# EAGLE design quadcopter (EAGLE 9.7.0)
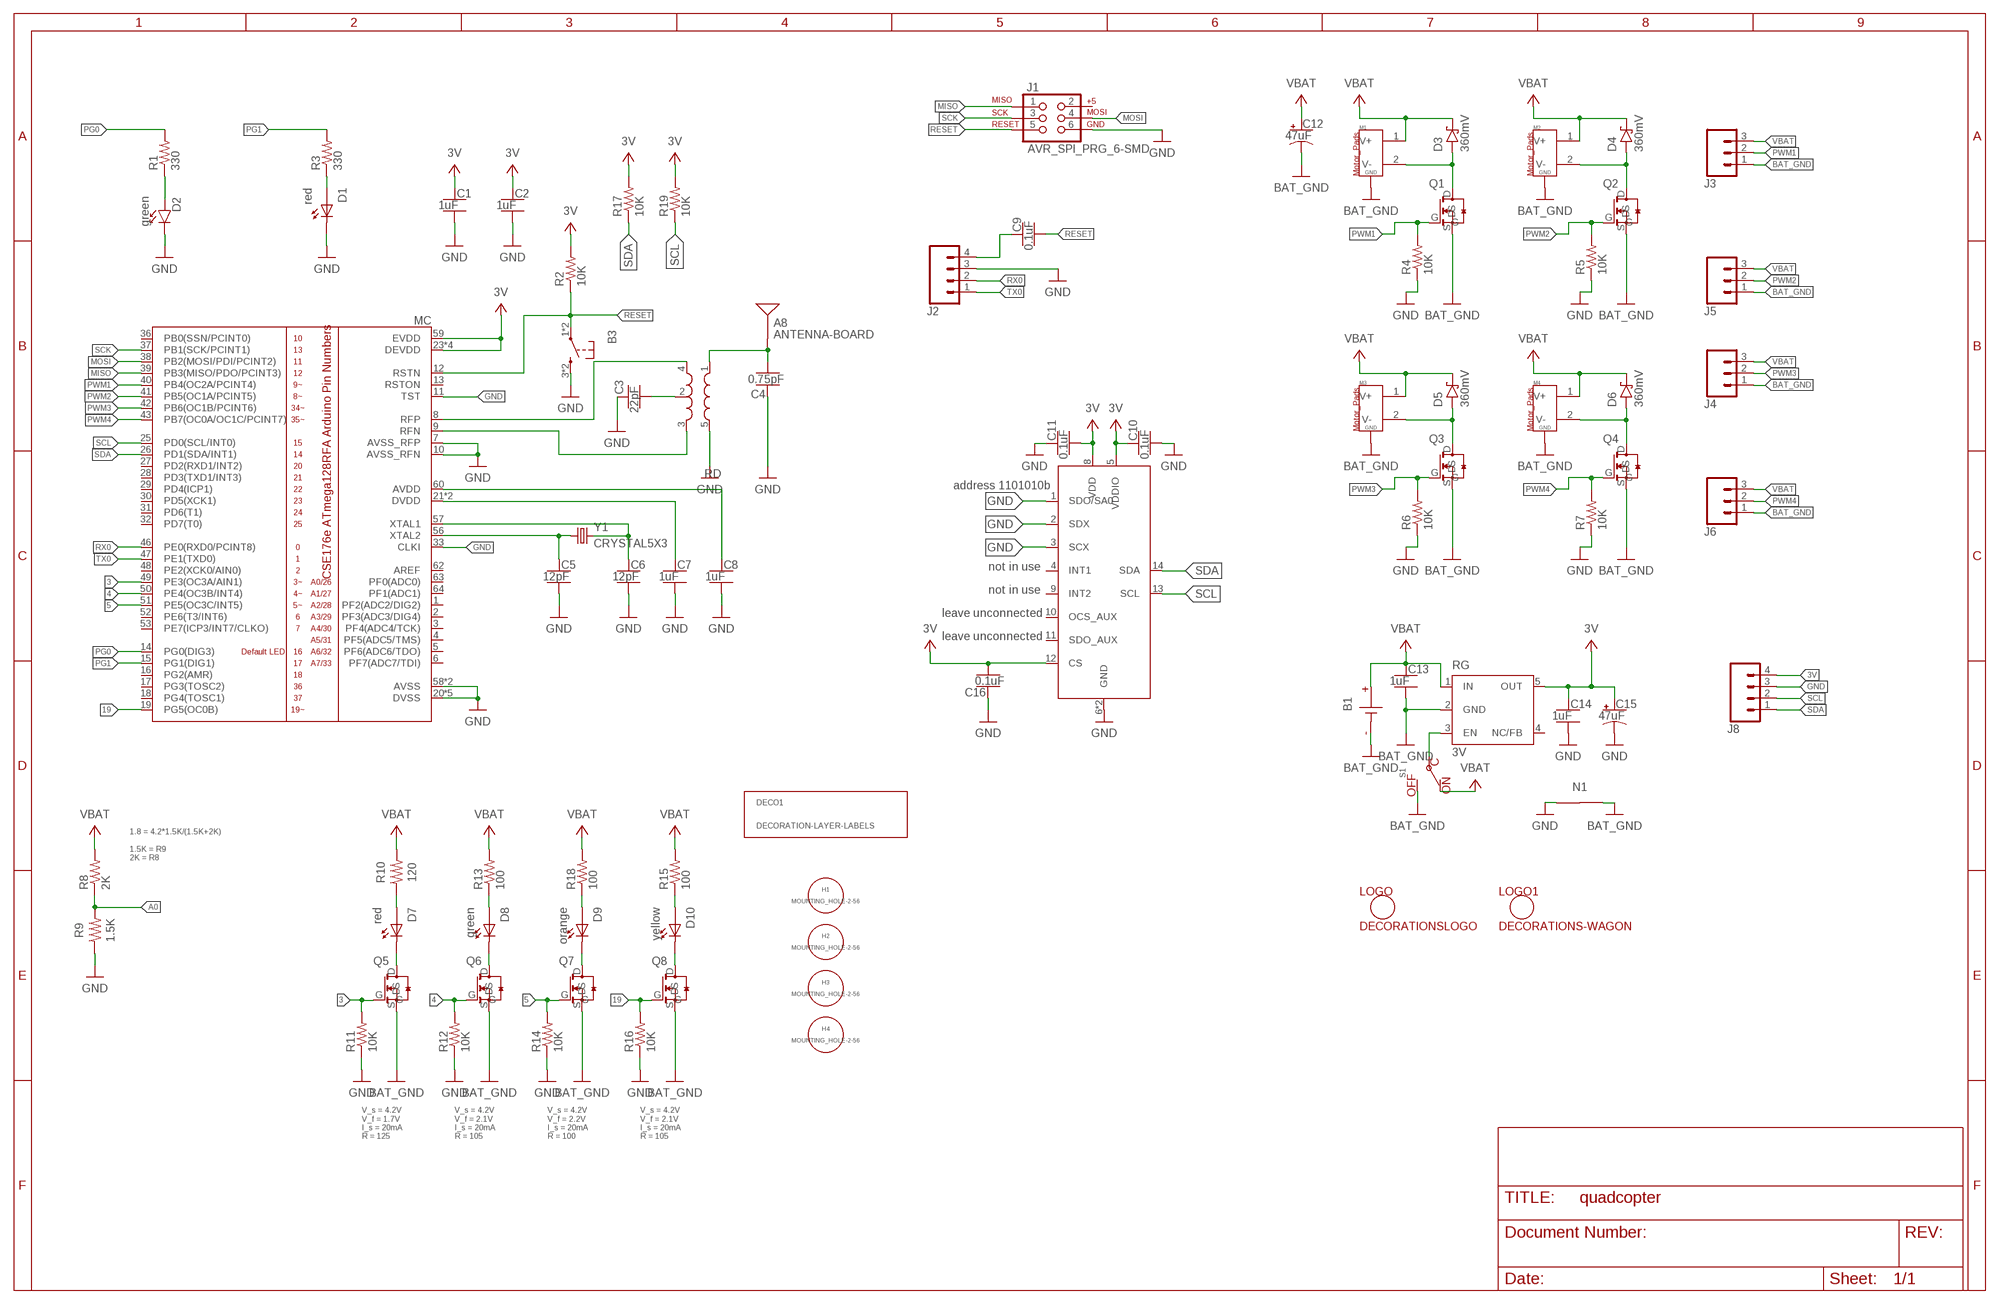
[diagram p0: schematic, sheet 1]
FRAME1 (FRAME_B_L): CREATOR: Unknown; DIST: Unknown; DISTPN: Unknown

## Parts
A8  ANTENNA-BOARD  [ANT_PCB_2.4GHZ_NRF8001_1.6MM_1OZ]
B1  BATTERY-SCREW-TERMINAL  [SCREW-TERMINAL-1X2-2.54MM]
B3  PUSHBUTTON_SMD-VERTICAL-1  [TE_FSM8JSMA_HS]
C1  1uF  CAPACITOR-NP_SMD-2012-0805_CERAMIC-1UF  [CAPC2012X140_HS]
C2  1uF  CAPACITOR-NP_SMD-2012-0805_CERAMIC-1UF  [CAPC2012X140_HS]
C3  22pF  CAPACITOR-NP_SMD-2012-0805_CERAMIC-22PF  [CAPC2012X140_HS]
C4  0.75pF  CAPACITOR-NP_SMD-2012-0805_CERAMIC-0.75PF  [CAPC2012X140_HS]
C5  12pF  CAPACITOR-NP_SMD-2012-0805_CERAMIC-12PF  [CAPC2012X140_HS]
C6  12pF  CAPACITOR-NP_SMD-2012-0805_CERAMIC-12PF  [CAPC2012X140_HS]
C7  1uF  CAPACITOR-NP_SMD-2012-0805_CERAMIC-1UF  [CAPC2012X140_HS]
C8  1uF  CAPACITOR-NP_SMD-2012-0805_CERAMIC-1UF  [CAPC2012X140_HS]
C9  0.1uF  CAPACITOR-NP_SMD-2012-0805_CERAMIC-0.1UF  [CAPC2012X140_HS]
C10  0.1uF  CAPACITOR-NP_SMD-2012-0805_CERAMIC-0.1UF  [CAPC2012X140_HS]
C11  0.1uF  CAPACITOR-NP_SMD-2012-0805_CERAMIC-0.1UF  [CAPC2012X140_HS]
C12  47uF  CAPACITOR-POL_47UF-SMD-1206-TAJA  [CAPMP3216X180]
C13  1uF  CAPACITOR-NP_SMD-2012-0805_CERAMIC-1UF  [CAPC2012X140_HS]
C14  1uF  CAPACITOR-NP_SMD-2012-0805_CERAMIC-1UF  [CAPC2012X140_HS]
C15  47uF  CAPACITOR-POL_47UF-SMD-1206-TAJA  [CAPMP3216X180]
C16  0.1uF  CAPACITOR-NP_SMD-2012-0805_CERAMIC-0.1UF  [CAPC2012X140_HS]
D1  red  LED-REDD-0805  [0805_LED]
D2  green  DIODE-LED_SMD-2012-0805-GREEN  [LEDSC125X200X120-2_HS]
D3  360mV  DIODE-SCHOTTKY_-SMD-SOD123  [SODFL3516X96]
D4  360mV  DIODE-SCHOTTKY_-SMD-SOD123  [SODFL3516X96]
D5  360mV  DIODE-SCHOTTKY_-SMD-SOD123  [SODFL3516X96]
D6  360mV  DIODE-SCHOTTKY_-SMD-SOD123  [SODFL3516X96]
D7  red  LED-RED-0805  [0805_LED]
D8  green  LED-GREEN-0805  [0805_LED]
D9  orange  LED-ORANGE-0805  [0805_LED]
D10  yellow  LED-YELLOW-0805  [0805_LED]
DECO1  DECORATION-LAYER-LABELS  [LAYER_LABELS]
H1  MOUNTING_HOLE-2-56  [2-56-MOUNTING-HOLE-NO-METAL]
H2  MOUNTING_HOLE-2-56  [2-56-MOUNTING-HOLE-NO-METAL]
H3  MOUNTING_HOLE-2-56  [2-56-MOUNTING-HOLE-NO-METAL]
H4  MOUNTING_HOLE-2-56  [2-56-MOUNTING-HOLE-NO-METAL]
IM  LSM_IMU-LGA-14L-6AXIS  [IMU_LSM6DS0X]
J1  AVR_SPI_PRG_6-SMD  [2X3-SMD]
J2  HEADER-4POS-0.1IN-FEMALE-SMD-BOTTOM-ENTRY  [HEADER-1X4-BOTTOM-ENTRY]
J3  HEADER-0.1IN-3POS  [HDRVR3W80P254_1X3_812X254X850B]
J4  HEADER-0.1IN-3POS  [HDRVR3W80P254_1X3_812X254X850B]
J5  HEADER-0.1IN-3POS  [HDRVR3W80P254_1X3_812X254X850B]
J6  HEADER-0.1IN-3POS  [HDRVR3W80P254_1X3_812X254X850B]
J8  HEADER-4POS-0.1IN-FEMALE  [HDRVR4W80P254_1X4_1066X254X850B]
LOGO  DECORATIONSLOGO  [LOGO]
LOGO1  DECORATIONS-WAGON  [WAGON]
M1  MOTOR_PADS_GND-MOLEX-SMD  [MOLEX-0532610271]
M2  MOTOR_PADS_GND-MOLEX-SMD  [MOLEX-0532610271]
M3  MOTOR_PADS_GND-MOLEX-SMD  [MOLEX-0532610271]
M4  MOTOR_PADS_GND-MOLEX-SMD  [MOLEX-0532610271]
MC  ATMEGA128RFA1  [QFN-64]
N1  NET_BRIDGE-NETTONET  [NET_BRIDGE]
Q1  MOSFET-SOT-23-NMOSFET  [SOT23-3-NMOSFET]
Q2  MOSFET-SOT-23-NMOSFET  [SOT23-3-NMOSFET]
Q3  MOSFET-SOT-23-NMOSFET  [SOT23-3-NMOSFET]
Q4  MOSFET-SOT-23-NMOSFET  [SOT23-3-NMOSFET]
Q5  MOSFET-SOT-23-NMOSFET  [SOT23-3-NMOSFET]
Q6  MOSFET-SOT-23-NMOSFET  [SOT23-3-NMOSFET]
Q7  MOSFET-SOT-23-NMOSFET  [SOT23-3-NMOSFET]
Q8  MOSFET-SOT-23-NMOSFET  [SOT23-3-NMOSFET]
R1  330  RESISTOR_SMD-2012-0805-330  [RESC2012X60_HS]
R2  10K  RESISTOR_SMD-2012-0805-10K  [RESC2012X60_HS]
R3  330  RESISTOR_SMD-2012-0805-330  [RESC2012X60_HS]
R4  10K  RESISTOR_SMD-2012-0805-10K  [RESC2012X60_HS]
R5  10K  RESISTOR_SMD-2012-0805-10K  [RESC2012X60_HS]
R6  10K  RESISTOR_SMD-2012-0805-10K  [RESC2012X60_HS]
R7  10K  RESISTOR_SMD-2012-0805-10K  [RESC2012X60_HS]
R8  2K  RESISTOR_SMD-2012-0805-2K  [RESC2012X60_HS]
R9  1.5K  RESISTOR-0805-1.5KOHM  [0805_RESISTOR]
R10  120  RESISTOR-0805-120OHM  [0805_RESISTOR]
R11  10K  RESISTOR_SMD-2012-0805-10K  [RESC2012X60_HS]
R12  10K  RESISTOR_SMD-2012-0805-10K  [RESC2012X60_HS]
R13  100  RESISTOR_SMD-2012-0805-100  [RESC2012X60_HS]
R14  10K  RESISTOR_SMD-2012-0805-10K  [RESC2012X60_HS]
R15  100  RESISTOR_SMD-2012-0805-100  [RESC2012X60_HS]
R16  10K  RESISTOR_SMD-2012-0805-10K  [RESC2012X60_HS]
R17  10K  RESISTOR_SMD-2012-0805-10K  [RESC2012X60_HS]
R18  100  RESISTOR_SMD-2012-0805-100  [RESC2012X60_HS]
R19  10K  RESISTOR_SMD-2012-0805-10K  [RESC2012X60_HS]
RD  BALUN0805  [BALUN]
RG  3V  TPS73633-DBVT3V  [SOT23-DBV]
S1  POWER-SWITCH-MFS201N-9-Z-SMD-EDGE  [JS102011SAQN]
Y1  CRYSTAL5X3  [CRYSTAL-SMD-5X3]

## Nets
3: MC.49(PE3(OC3A/AIN1)) Q5.G R11.2
3V [PWR]: C1.1 C2.1 C10.1 C11.2 C14.1 C15.1(+) C16.2 IM.5(VDDIO) IM.8(VDD) IM.12(CS) J8.4 MC.23(DEVDD) MC.34(DEVDD) MC.44(DEVDD) MC.54(DEVDD) MC.59(EVDD) R2.2 R17.2 R19.2 RG.5(OUT)
4: MC.50(PE4(OC3B/INT4)) Q6.G R12.2
5: MC.51(PE5(OC3C/INT5)) Q7.G R14.2
19: MC.19(PG5(OC0B)) Q8.G R16.2
A0: R8.1 R9.2
BAT_GND [HIGHCURRENT]: B1.1(N) C12.2(-) C13.2 J3.1 J4.1 J5.1 J6.1 M1.G1(GND) M1.G2(GND) M2.G1(GND) M2.G2(GND) M3.G1(GND) M3.G2(GND) M4.G1(GND) M4.G2(GND) N1.1 Q1.S Q2.S Q3.S Q4.S Q5.S Q6.S Q7.S Q8.S RG.2(GND) S1.A(OFF)
GND [PWR]: B3.3 B3.4 C1.2 C2.2 C3.1 C4.1 C5.2 C6.2 C7.2 C8.2 C10.2 C11.1 C14.2 C15.2(-) C16.1 D1.C D2.C IM.1(SDO/SA0) IM.2(SDX) IM.3(SCX) IM.6(GND) IM.7(GND) J1.6 J2.3 J8.3 MC.7(AVSS_RFP) MC.10(AVSS_RFN) MC.11(TST) MC.20(DVSS) MC.24(DVSS) MC.33(CLKI) MC.35(DVSS) MC.45(DVSS) MC.55(DVSS) MC.58(AVSS) MC.61(AVSS) N1.2 R4.1 R5.1 R6.1 R7.1 R9.1 R11.1 R12.1 R14.1 R16.1 RD.5(GND)
MISO: J1.1 MC.39(PB3(MISO/PDO/PCINT3))
MOSI: J1.4 MC.38(PB2(MOSI/PDI/PCINT2))
N$1: D1.A R3.1
N$2: C9.1 J2.4
N$3: C3.2 RD.2(GND)
N$4: MC.8(RFP) RD.4(OUT1)
N$5: MC.9(RFN) RD.3(OUT2)
N$6 [RFSIG]: A8.FEED(SIGNAL) C4.2 RD.1(IN)
N$7: C8.1 MC.60(AVDD)
N$8: C7.1 MC.21(DVDD) MC.22(DVDD)
N$9: C6.1 MC.57(XTAL1) Y1.3
N$10: C5.1 MC.56(XTAL2) Y1.1
N$11: D2.A R1.1
N$12 [HIGHCURRENT]: D3.2(A) M1.2(V-) Q1.D
N$13 [HIGHCURRENT]: D4.2(A) M2.2(V-) Q2.D
N$14 [HIGHCURRENT]: D5.2(A) M3.2(V-) Q3.D
N$15 [HIGHCURRENT]: D6.2(A) M4.2(V-) Q4.D
N$16: RG.3(EN) S1.C
N$19: D7.C Q5.D
N$20: D7.A R10.1
N$23: D8.C Q6.D
N$24: D8.A R13.1
N$27: D9.C Q7.D
N$28: D9.A R18.1
N$31: D10.C Q8.D
N$32: D10.A R15.1
PG0: MC.14(PG0(DIG3)) R1.2
PG1: MC.15(PG1(DIG1)) R3.2
PWM1: J3.2 MC.40(PB4(OC2A/PCINT4)) Q1.G R4.2
PWM2: J5.2 MC.41(PB5(OC1A/PCINT5)) Q2.G R5.2
PWM3: J4.2 MC.42(PB6(OC1B/PCINT6)) Q3.G R6.2
PWM4: J6.2 MC.43(PB7(OC0A/OC1C/PCINT7)) Q4.G R7.2
RESET: B3.1 B3.2 C9.2 J1.5 MC.12(RSTN) R2.1
RX0: J2.2 MC.46(PE0(RXD0/PCINT8))
SCK: J1.3 MC.37(PB1(SCK/PCINT1))
SCL: IM.13(SCL) J8.2 MC.25(PD0(SCL/INT0)) R19.1
SDA: IM.14(SDA) J8.1 MC.26(PD1(SDA/INT1)) R17.1
TX0: J2.1 MC.47(PE1(TXD0))
VBAT [HIGHCURRENT]: B1.2(P) C12.1(+) C13.1 D3.1(C) D4.1(C) D5.1(C) D6.1(C) J3.3 J4.3 J5.3 J6.3 M1.1(V+) M2.1(V+) M3.1(V+) M4.1(V+) R8.2 R10.2 R13.2 R15.2 R18.2 RG.1(IN) S1.B(ON)
Unconnected: IM.4(INT1) IM.9(INT2) IM.10(OCS_AUX) IM.11(SDO_AUX) J1.2 MC.1(PF2(ADC2/DIG2)) MC.2(PF3(ADC3/DIG4)) MC.3(PF4(ADC4/TCK)) MC.4(PF5(ADC5/TMS)) MC.5(PF6(ADC6/TDO)) MC.6(PF7(ADC7/TDI)) MC.13(RSTON) MC.16(PG2(AMR)) MC.17(PG3(TOSC2)) MC.18(PG4(TOSC1)) MC.27(PD2(RXD1/INT2)) MC.28(PD3(TXD1/INT3)) MC.29(PD4(ICP1)) MC.30(PD5(XCK1)) MC.31(PD6(T1)) MC.32(PD7(T0)) MC.36(PB0(SSN/PCINT0)) MC.48(PE2(XCK0/AIN0)) MC.52(PE6(T3/INT6)) MC.53(PE7(ICP3/INT7/CLKO)) MC.62(AREF) MC.63(PF0(ADC0)) MC.64(PF1(ADC1)) RG.4(NC/FB)

## Notes on the sheet
- address 1101010b
- not in use
- not in use
- leave unconnected
- leave unconnected
- 1.8 = 4.2*1.5K/(1.5K+2K)
  
  1.5K = R9
  2K = R8
- V_s = 4.2V
  V_f = 1.7V
  I_s = 20mA
  R = 125
- V_s = 4.2V
  V_f = 2.1V
  I_s = 20mA
  R = 105
- V_s = 4.2V
  V_f = 2.2V
  I_s = 20mA
  R = 100
- V_s = 4.2V
  V_f = 2.1V
  I_s = 20mA
  R = 105

## Library data of the parts
A8 = quadparts_prebuilt_2022:ANTENNA: Single endded antenna.; CREATOR: Swanson; DESC: trace antenna; DIST: NA; DISTPN: NA; MFR: NA; MOUNTING: NONE; MPN: NA; POPULATE: NO
B1 = quadparts_prebuilt_2022:BATTERY: Connections for a battery.; CREATOR: Swanson; DIST: DIGIKEY; DISTPN: ED10561-ND; MOUNTING: TH; PIN1: -; PIN2: +
B3 = quadparts_prebuilt_2022:PUSHBUTTON_: "Tactile" or "clicky" button.; CREATOR: Swanson; DIST: Digikey; DISTPN: 450-1129-ND; MFR: TE Connectivity Alcoswitch Switches; MOUNTING: SMD; MPN: FSM4JSMA; REVIEWER: Swanson
C1 C2 C7 C8 C13 C14 = quadparts_prebuilt_2022:CAPACITOR-NP_: Nonpolarized capacitor; CREATOR: Swanson; DIST: Digikey; DISTPN: 587-1281-1-ND; MFR: Taiyo Yuden; MOUNTING: SMD; MPN: TMK212B7105KG-T; REVIEWER: Swanson
C3 = quadparts_prebuilt_2022:CAPACITOR-NP_: Nonpolarized capacitor; CREATOR: Swanson; DESC: CAP CER 22PF 250V C0G/NP0 0805; DIST: Digikey; DISTPN: 490-5534-1-ND; MFR: Murata Electronics; MOUNTING: SMD; MPN: GRM21A5C2E220JW01D; PACKAGE: 0805; REVIEWER: Swanson
C4 = quadparts_prebuilt_2022:CAPACITOR-NP_: Nonpolarized capacitor; CREATOR: Swanson; DESC: CAP CER 0.75PF 100V C0G/NP0 0805; DIST: Digikey; DISTPN: 490-3585-1-ND; MFR: Murata Electronics; MOUNTING: SMD; MPN: GQM2195C2AR75CB01D; PACKAGE: 0805; REVIEWER: Swanson
C5 C6 = quadparts_prebuilt_2022:CAPACITOR-NP_: Nonpolarized capacitor; CREATOR: Swanson; DESC: CAP CER 12PF 250V C0G/NP0 0805; DIST: Digikey; DISTPN: 490-5531-1-ND; MFR: Murata Electronics; MOUNTING: SMD; MPN: GRM21A5C2E120JW01D; PACKAGE: 0805; REVIEWER: Swanson
C9-C11 C16 = quadparts_prebuilt_2022:CAPACITOR-NP_: Nonpolarized capacitor; CREATOR: Swanson; DESC: CAP CER 0.1UF 100V X7R 0805; DIST: Digikey; DISTPN: 445-1418-1-ND; MFR: TDK Corporation; MOUNTING: SMD; MPN: C2012X7R2A104K125AA; PACKAGE: 0805; REVIEWER: Swanson
C12 C15 = quadparts_prebuilt_2022:CAPACITOR-POL_: Polarized capacitor; CREATOR: Swanson; DESC: CAP TANT 47UF 10% 6.3V 1206; DIST: DIGIKEY; DISTPN: 478-11462-1-ND; MFR: AVX Corporation; MOUNTING: SMD; MPN: TAJA476K006SNJV; PACKAGE: 1206
D1 = custom_amish:LED; CREATOR: B HO; DIST: Digikey; DISTPN: 160-1178-1-ND
D2 = quadparts_prebuilt_2022:DIODE-LED_: Light emitting diode; CREATOR: Swanson; DIST: Digikey; DISTPN: 160-1179-1-ND; MFR: Lite-On Inc; MOUNTING: SMD; MPN: LTST-C170GKT; REVIEWER: Swanson
D3-D6 = quadparts_prebuilt_2022:DIODE-SCHOTTKY_: Schottky diode; CREATOR: Swanson; DESC: DIODE SCHOTTKY 30V 1.5A SFLAT; DIST: Digikey; DISTPN: CRS08QMCT-ND; MFR: Toshiba Semiconductor and Storage; MOUNTING: SMD; MPN: CRS08(TE85L,Q,M); REVIEWER: Swanson
D7 = LED:LED; CREATOR: B HO; DIST: Digikey; DISTPN: 350-2889-ND
D8 = LED:LED; CREATOR: B HO; DIST: Digikey; DISTPN: 350-2892-ND
D9 = LED:LED; CREATOR: B HO; DIST: Digikey; DISTPN: 350-3831-ND
D10 = LED:LED; CREATOR: B HO; DIST: Digikey; DISTPN: 350-2953-1-ND
DECO1 = quadparts_prebuilt_2022:DECORATION
H1-H4 = quadparts_prebuilt_2022:MOUNTING_HOLE
IM = custom_amish:LSM_IMU; CREATOR: B HO; DIST: Digikey; DISTPN: 497-18367-1-ND
J1 = quadparts_prebuilt_2022:AVR_SPI_PRG_6: AVR ISP 6 Pin This is the in-system programming (ISP) connector for Atmel Microcontrollers programming.; CREATOR: Swanson; DESC: CONN HEADER SMD 6POS 2.54MM; DIST: Digikey; DISTPN: 609-3487-2-ND; MFR: Amphenol ICC (FCI); MOUNTING: SMD; MPN: 95278-101A06LF
J2 = quadparts_prebuilt_2022:HEADER-4POS; CREATOR: Swanson; DESC: CONN RCPT 4POS 0.1 GOLD SMD; DIST: DIGIKEY; DISTPN: A121787CT-ND; MFR: TE Connectivity AMP Connectors; MOUNTING: SMD; MPN: 1241152-4
J3-J6 = quadparts_prebuilt_2022:HEADER-0.1IN-3POS; CREATOR: Swanson; DIST: Digikey; DISTPN: S7001-ND
J8 = quadparts_prebuilt_2022:HEADER-4POS; CREATOR: Swanson; DIST: Digikey; DISTPN: S7002-ND
LOGO = custom_amish:DECORATIONS; CREATOR: B HO; DIST: N/A; DISTPN: N/A
LOGO1 = custom_amish:DECORATIONS
M1-M4 = quadparts_prebuilt_2022:MOTOR_PADS_GND: Connections a brushed motor.; CREATOR: Swanson; DESC: CONN HEADER SMD R/A 2POS 1.25MM; DIST: DIGIKEY; DISTPN: WM7620CT-ND; MFR: Molex; MOUNTING: SMD; MPN: 532610271
MC = quadparts_prebuilt_2022:ATMEGA128RFA1: ATmega128RFA1 8-bit AVR Microcontroller with Low Power 2.4GHz Transceiver for ZigBee and IEEE 802.15.4; CREATOR: Swanson; DATASHEET: http://www.atmel.com/Images/Atmel-8266-MCU_Wireless-ATmega128RFA1_Datasheet.pdf; DESC: IC RF TXRX+MCU 802.15.4 64VFQFN; DIST: Digikey; DISTPN: ATMEGA128RFA1-ZU-ND; MFR: Microchip Technology; MOUNTING: SMD; MPN: ATMEGA128RFA1-ZU; PACKAGE: QFN; PRICE: 10.21; REVIEWER: Swanson
N1 = custom_amish:NET_BRIDGE; CREATOR: J SOONG; DIST: N/A; DISTPN: N/A
Q1-Q8 = custom_amish:MOSFET; CREATOR: B HO; DIST: Digikey; DISTPN: SI2302CDS-T1-E3CT-ND
R1 R3 = quadparts_prebuilt_2022:RESISTOR_: Resistor; CREATOR: Swanson; DIST: Digikey; DISTPN: 311-330ARCT-ND; MFR: Yageo; MOUNTING: SMD; MPN: RC0805JR-07330RL; REVIEWER: Swanson
R2 R4-R7 R11 R12 R14 R16 R17 R19 = quadparts_prebuilt_2022:RESISTOR_: Resistor; CREATOR: Swanson; DESC: RES SMD 10K OHM 5% 1/8W 0805; DIST: Digikey; DISTPN: 311-10KARCT-ND; MFR: Yageo; MOUNTING: SMD; MPN: RC0805JR-0710KL; PACKAGE: 0805; REVIEWER: Swanson
R8 = quadparts_prebuilt_2022:RESISTOR_: Resistor; CREATOR: Swanson; DESC: RES SMD 2K OHM 1% 1/8W 0805; DIST: DIGIKEY; DISTPN: YAG3718CT-ND; MFR: YAGEO; MOUNTING: SMD; MPN: AC0805FR-072KL; PACKAGE: 0805
R9 = custom_amish:RESISTOR; CREATOR: B HO; DIST: Digikey; DISTPN: 311-1.5KARCT-ND
R10 = custom_amish:RESISTOR; CREATOR: B HO; DIST: Digikey; DISTPN: 311-120ARCT-ND
R13 R15 R18 = quadparts_prebuilt_2022:RESISTOR_: Resistor; CREATOR: Swanson; DIST: Digikey; DISTPN: 311-100ARCT-ND; MFR: Yageo; MOUNTING: SMD; MPN: RC0805JR-07100RL; REVIEWER: Swanson
RD = quadparts_prebuilt_2022:BALUN: A balun to convert differential radio-frequency outputs from the microcontroller into a single-ended driver for the antenna.; CREATOR: Swanson; DATASHEET: http://katalog.we-online.de/pbs/datasheet/748421245.pdf; DESC: BALUN 2.4GHZ-2.5GHZ 50/100 0805; DIST: Digikey; DISTPN: 732-2230-1-ND; MFR: Wurth Electronics Inc.; MOUNTING: SMD; MPN: 748421245; PACKAGE: 0805; PRICE: 2.63; REVIEWER: Swanson
RG = quadparts_prebuilt_2022:TPS73633-DBVT: LP3985-series voltage regulators.; CREATOR: Swanson; DATASHEET: http://www.ti.com/lit/ds/symlink/lp3985.pdf; DIST: Digikey; DISTPN: LP3985IM5X-3.0/NOPBCT-ND; MFR: Texas Instruments; MOUNTING: SMD; MPN: LP3985IM5X-3.0/NOPB; PRICE: 0.59; REVIEWER: Swanson
S1 = quadparts_prebuilt_2022:POWER-SWITCH-MFS201N-9-Z; CREATOR: Swanson; DESC: SWITCH SLIDE SPDT 300MA 6V; DIST: DIGIKEY; DISTPN: 401-1999-1-ND; MFR: C&K; MOUNTING: SMD; MPN: JS102011SAQN
Y1 = quadparts_prebuilt_2022:CRYSTAL: Crystals to provide clock references for microcontrollers, etc.; CREATOR: Swanson; DATASHEET: http://www.abracon.com/Resonators/abm3b.pdf; DESC: CRYSTAL 16.0000MHZ 18PF SMD; DIST: Digikey; DISTPN: 535-9122-1-ND; MFR: Abracon LLC; MOUNTING: SMD; MPN: ABM3B-16.000MHZ-B2-T; PRICE: 0.68; PROD_ID: XTAL-08218; REVIEWER: Swanson

## Net classes
0 DEFAULT: width 0.127 mm
1 PWR: width 0.254 mm
2 HIGHCURRENT: width 0.762 mm, drill 0.61 mm
3 RFSIG: width 1.27 mm

## Board
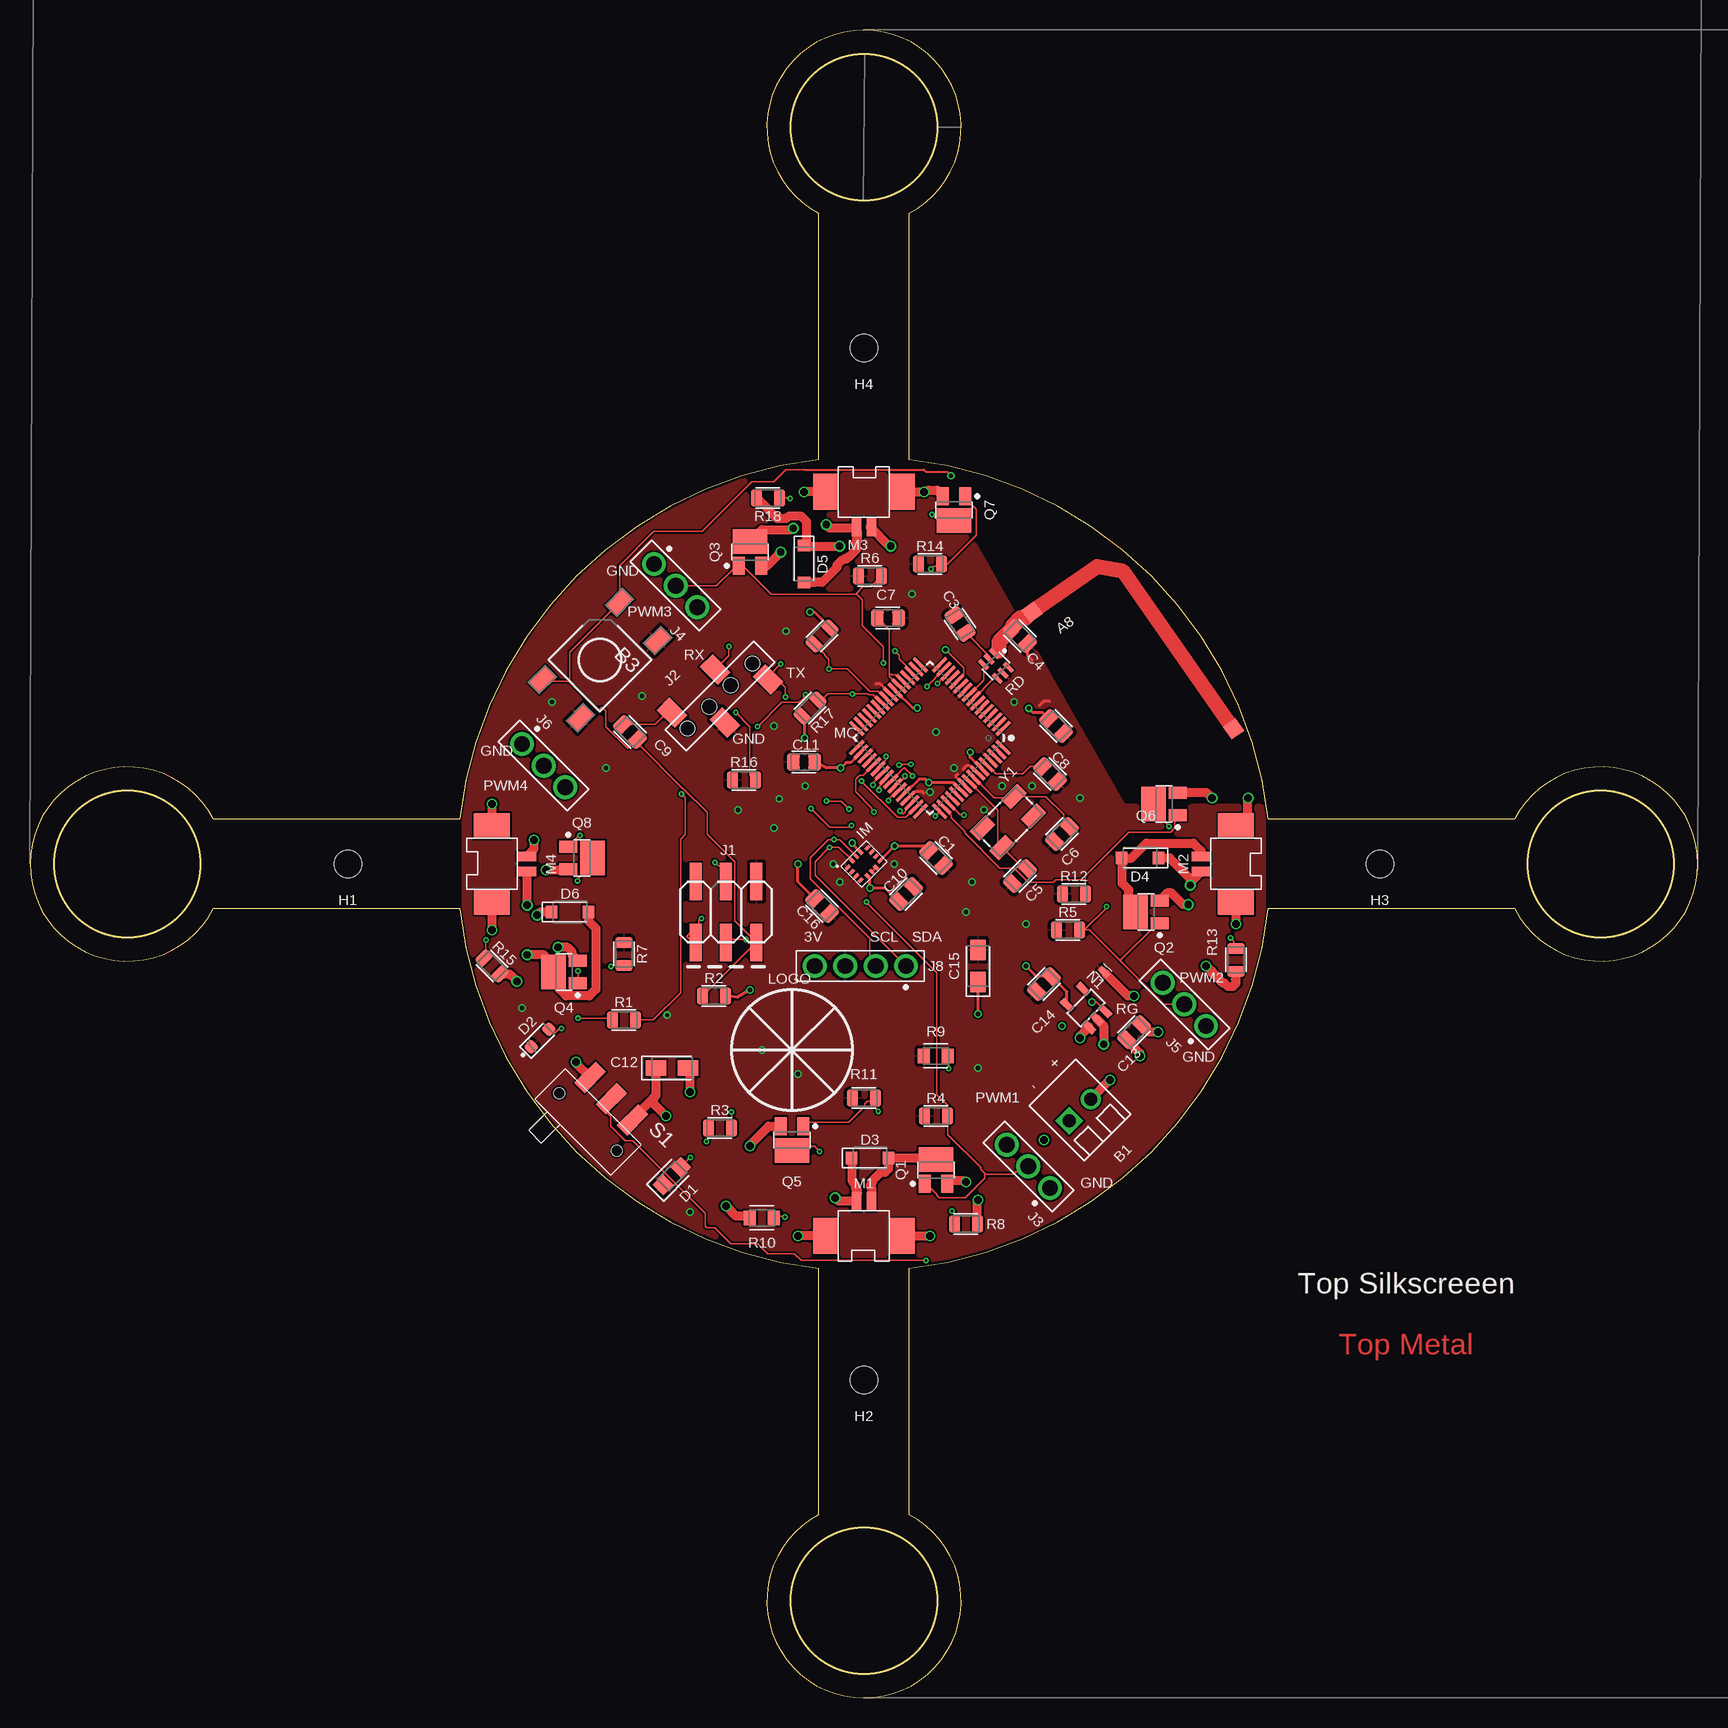
[diagram p1: board, top side]
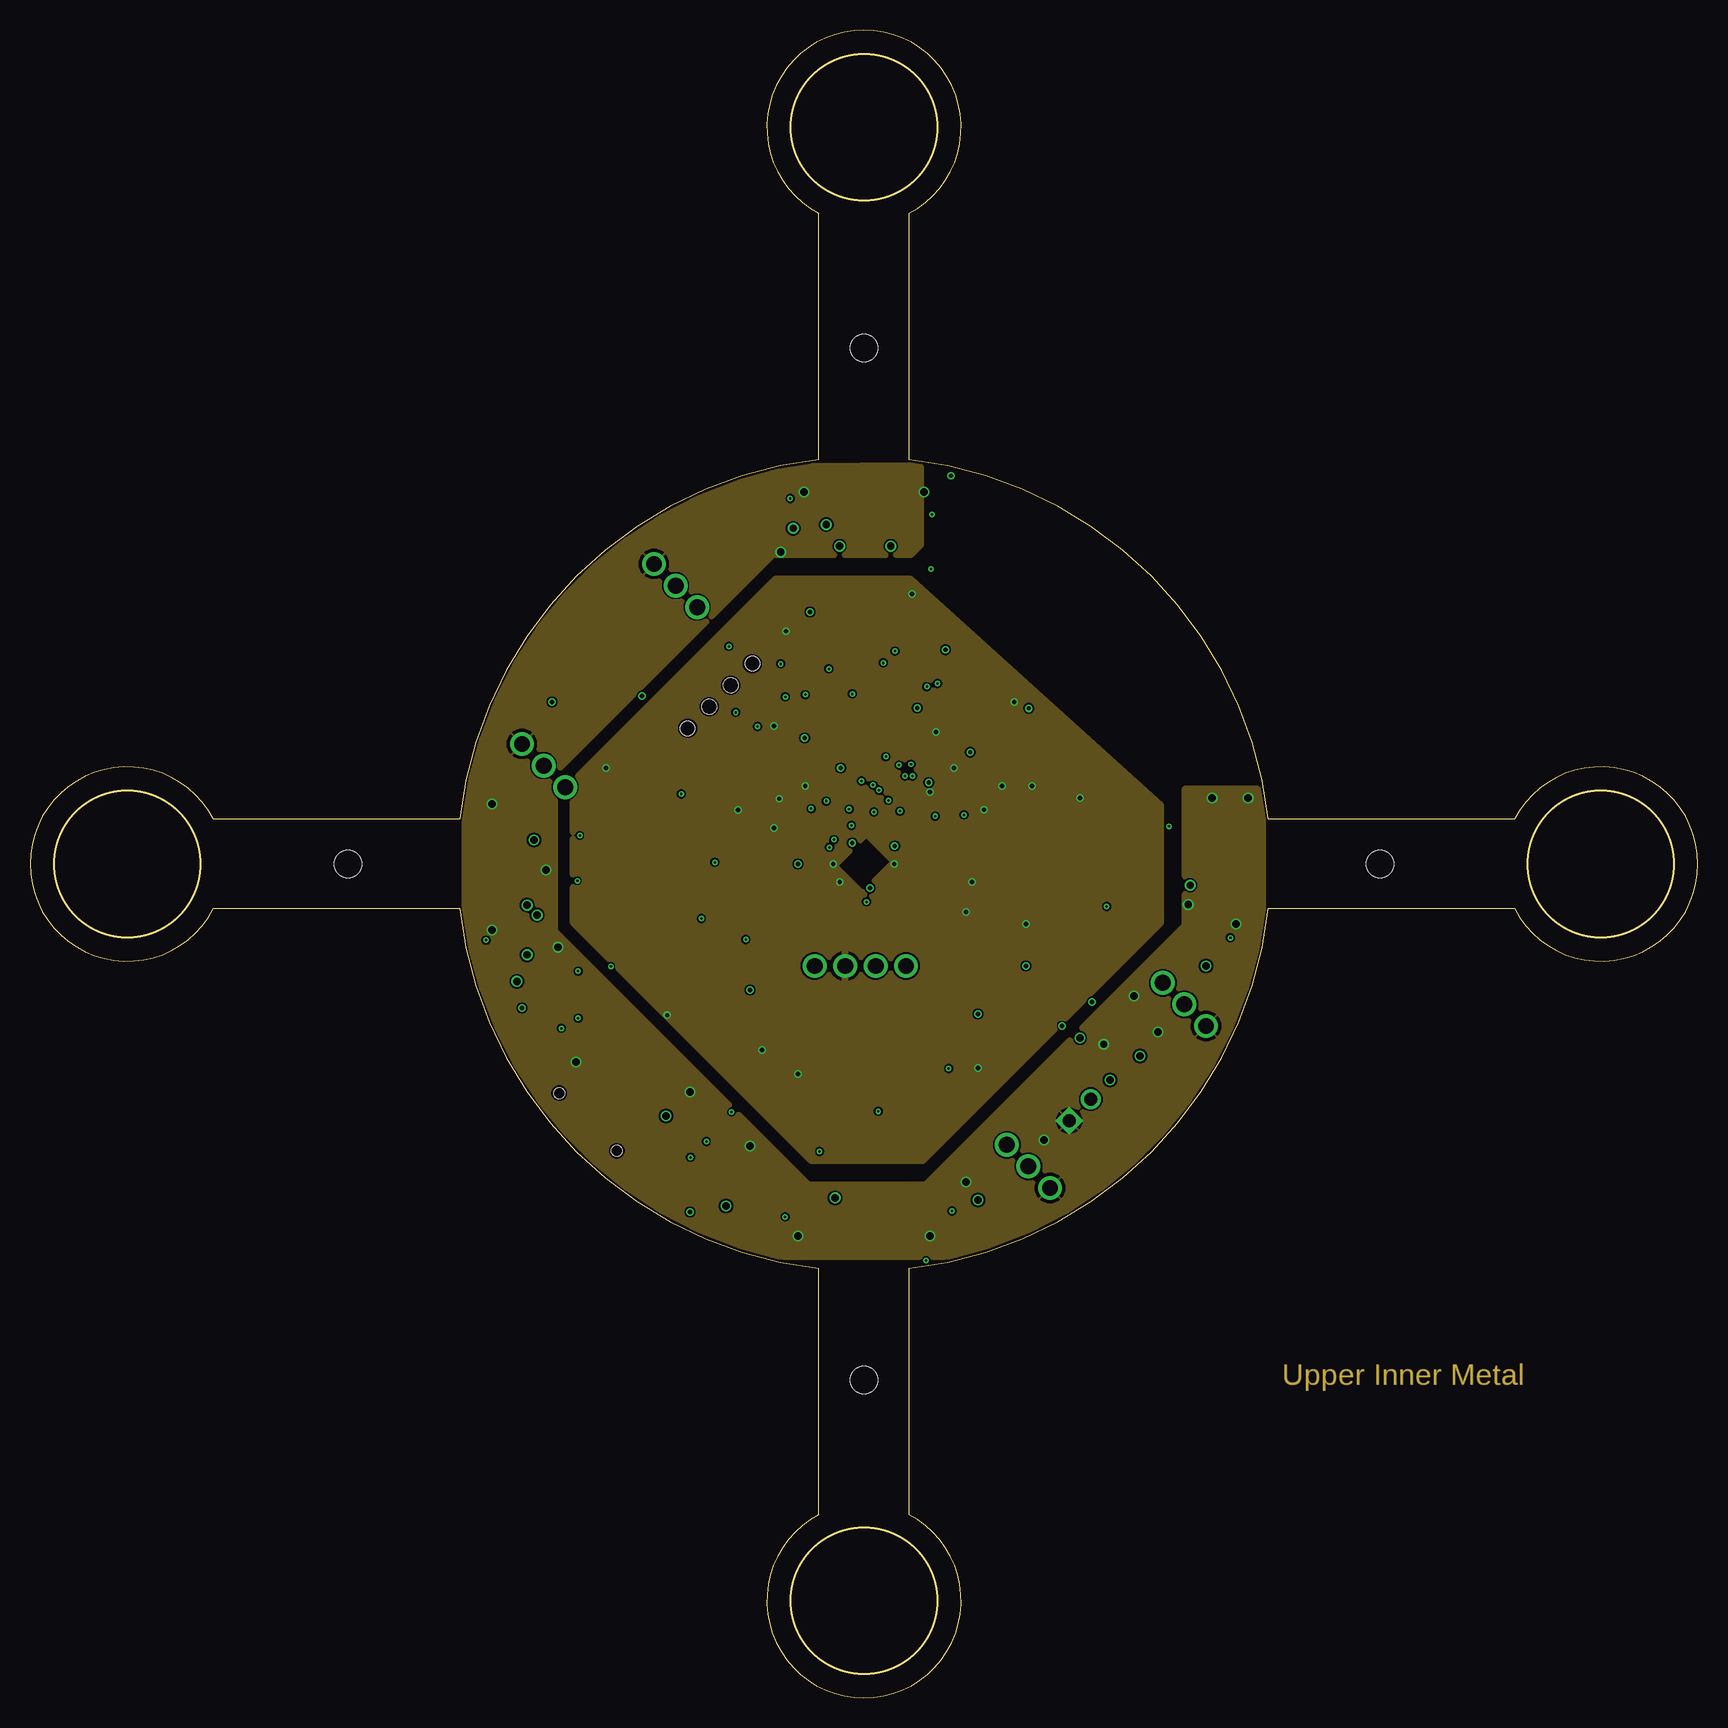
[diagram p2: board, inner layer Route2]
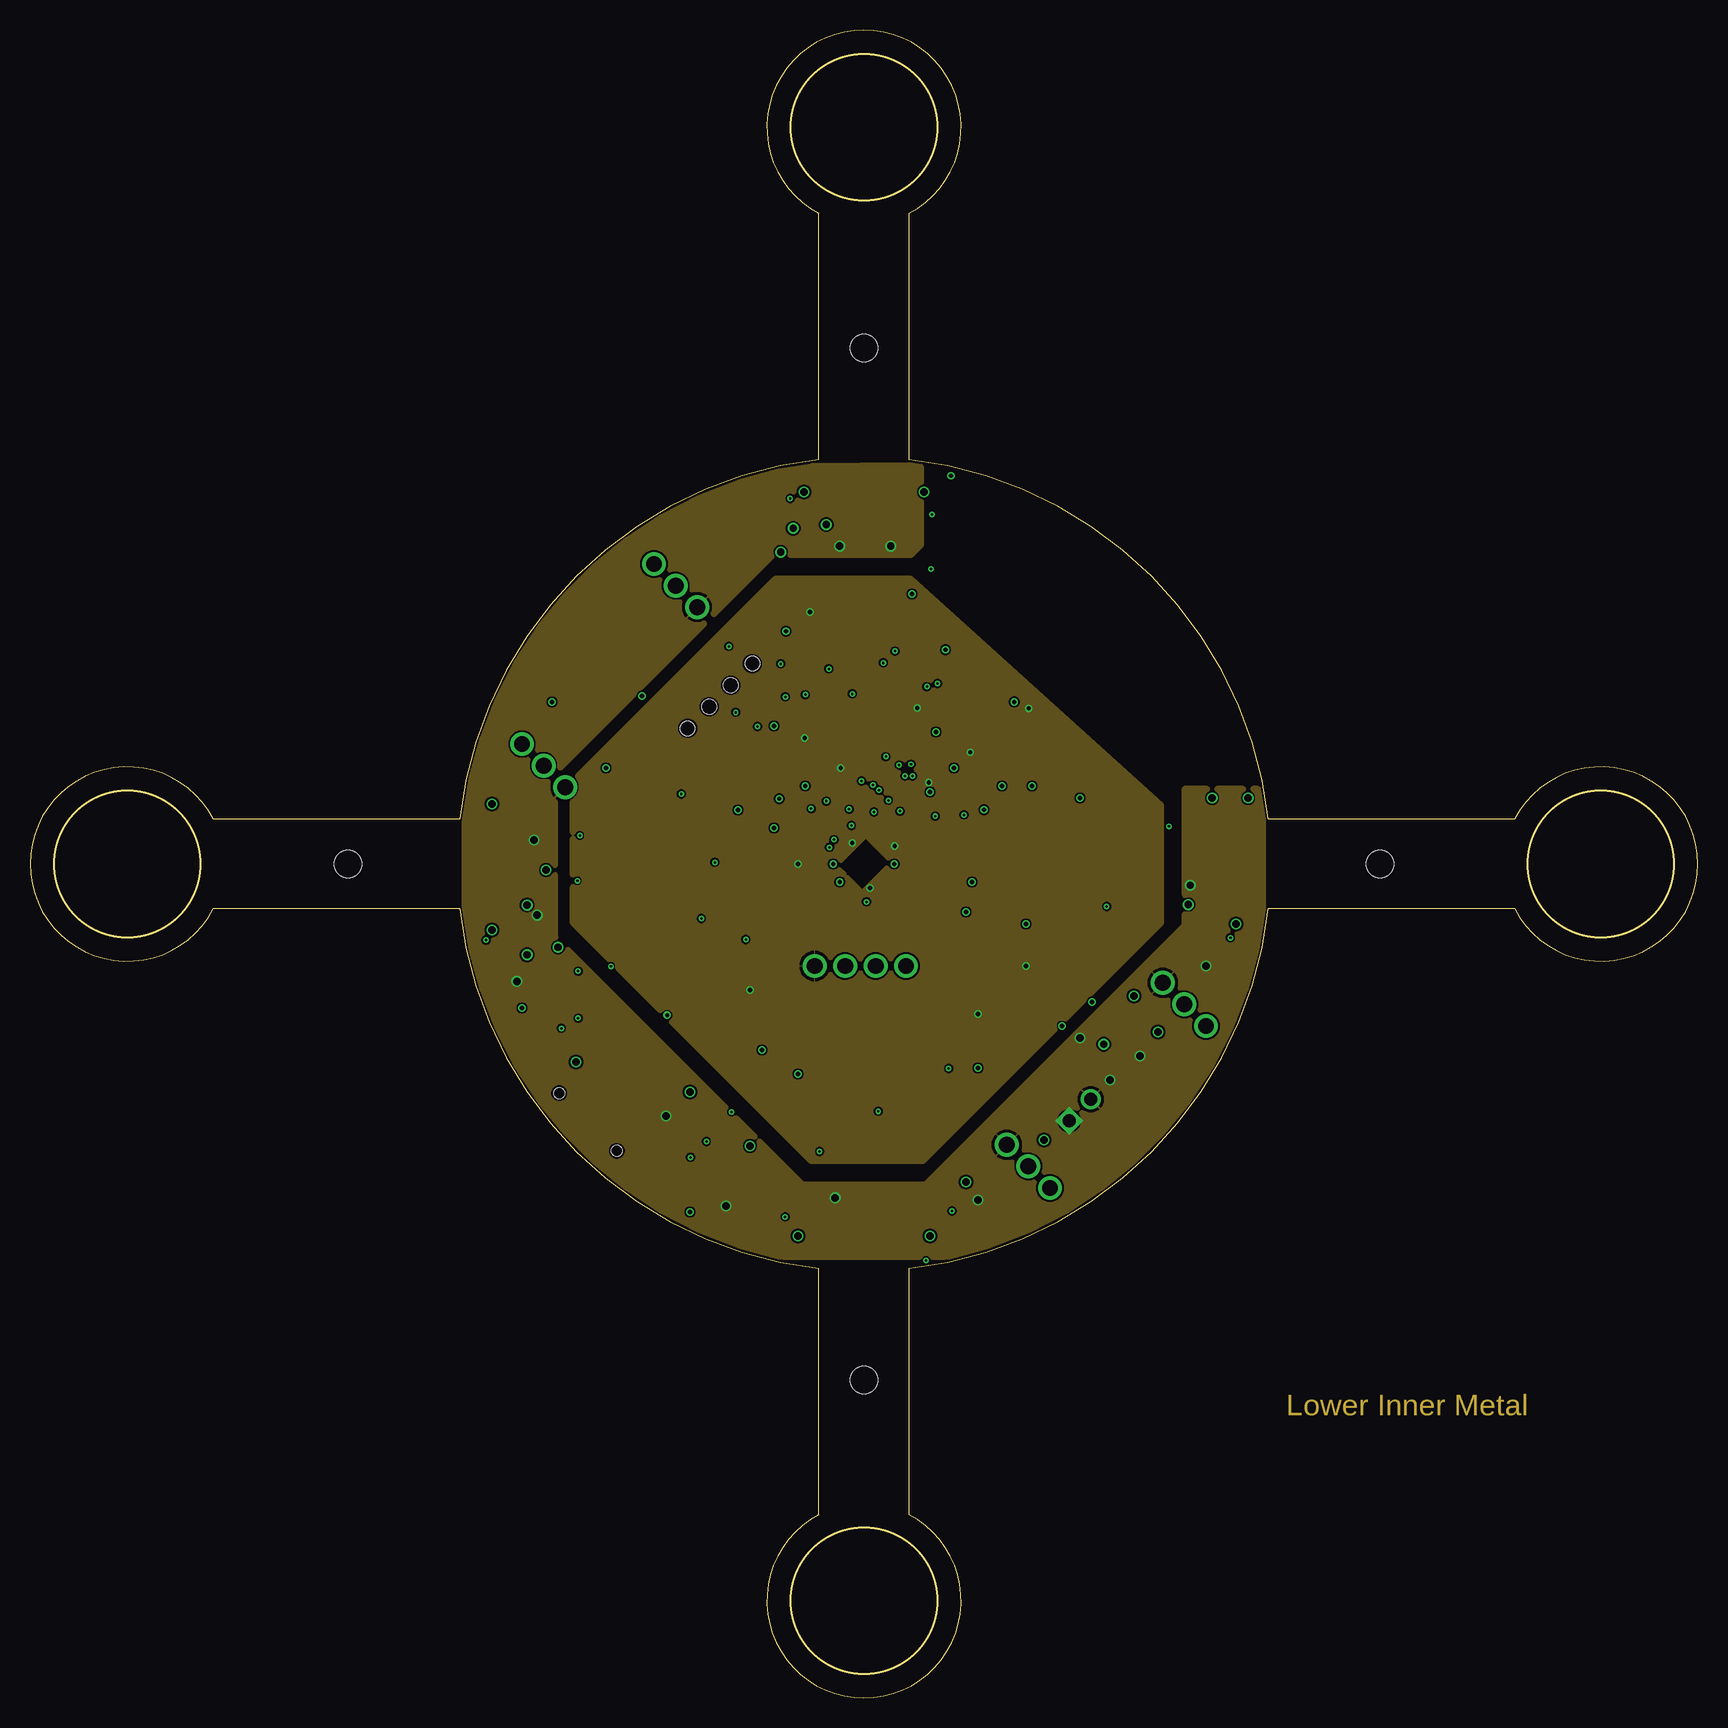
[diagram p3: board, inner layer Route15]
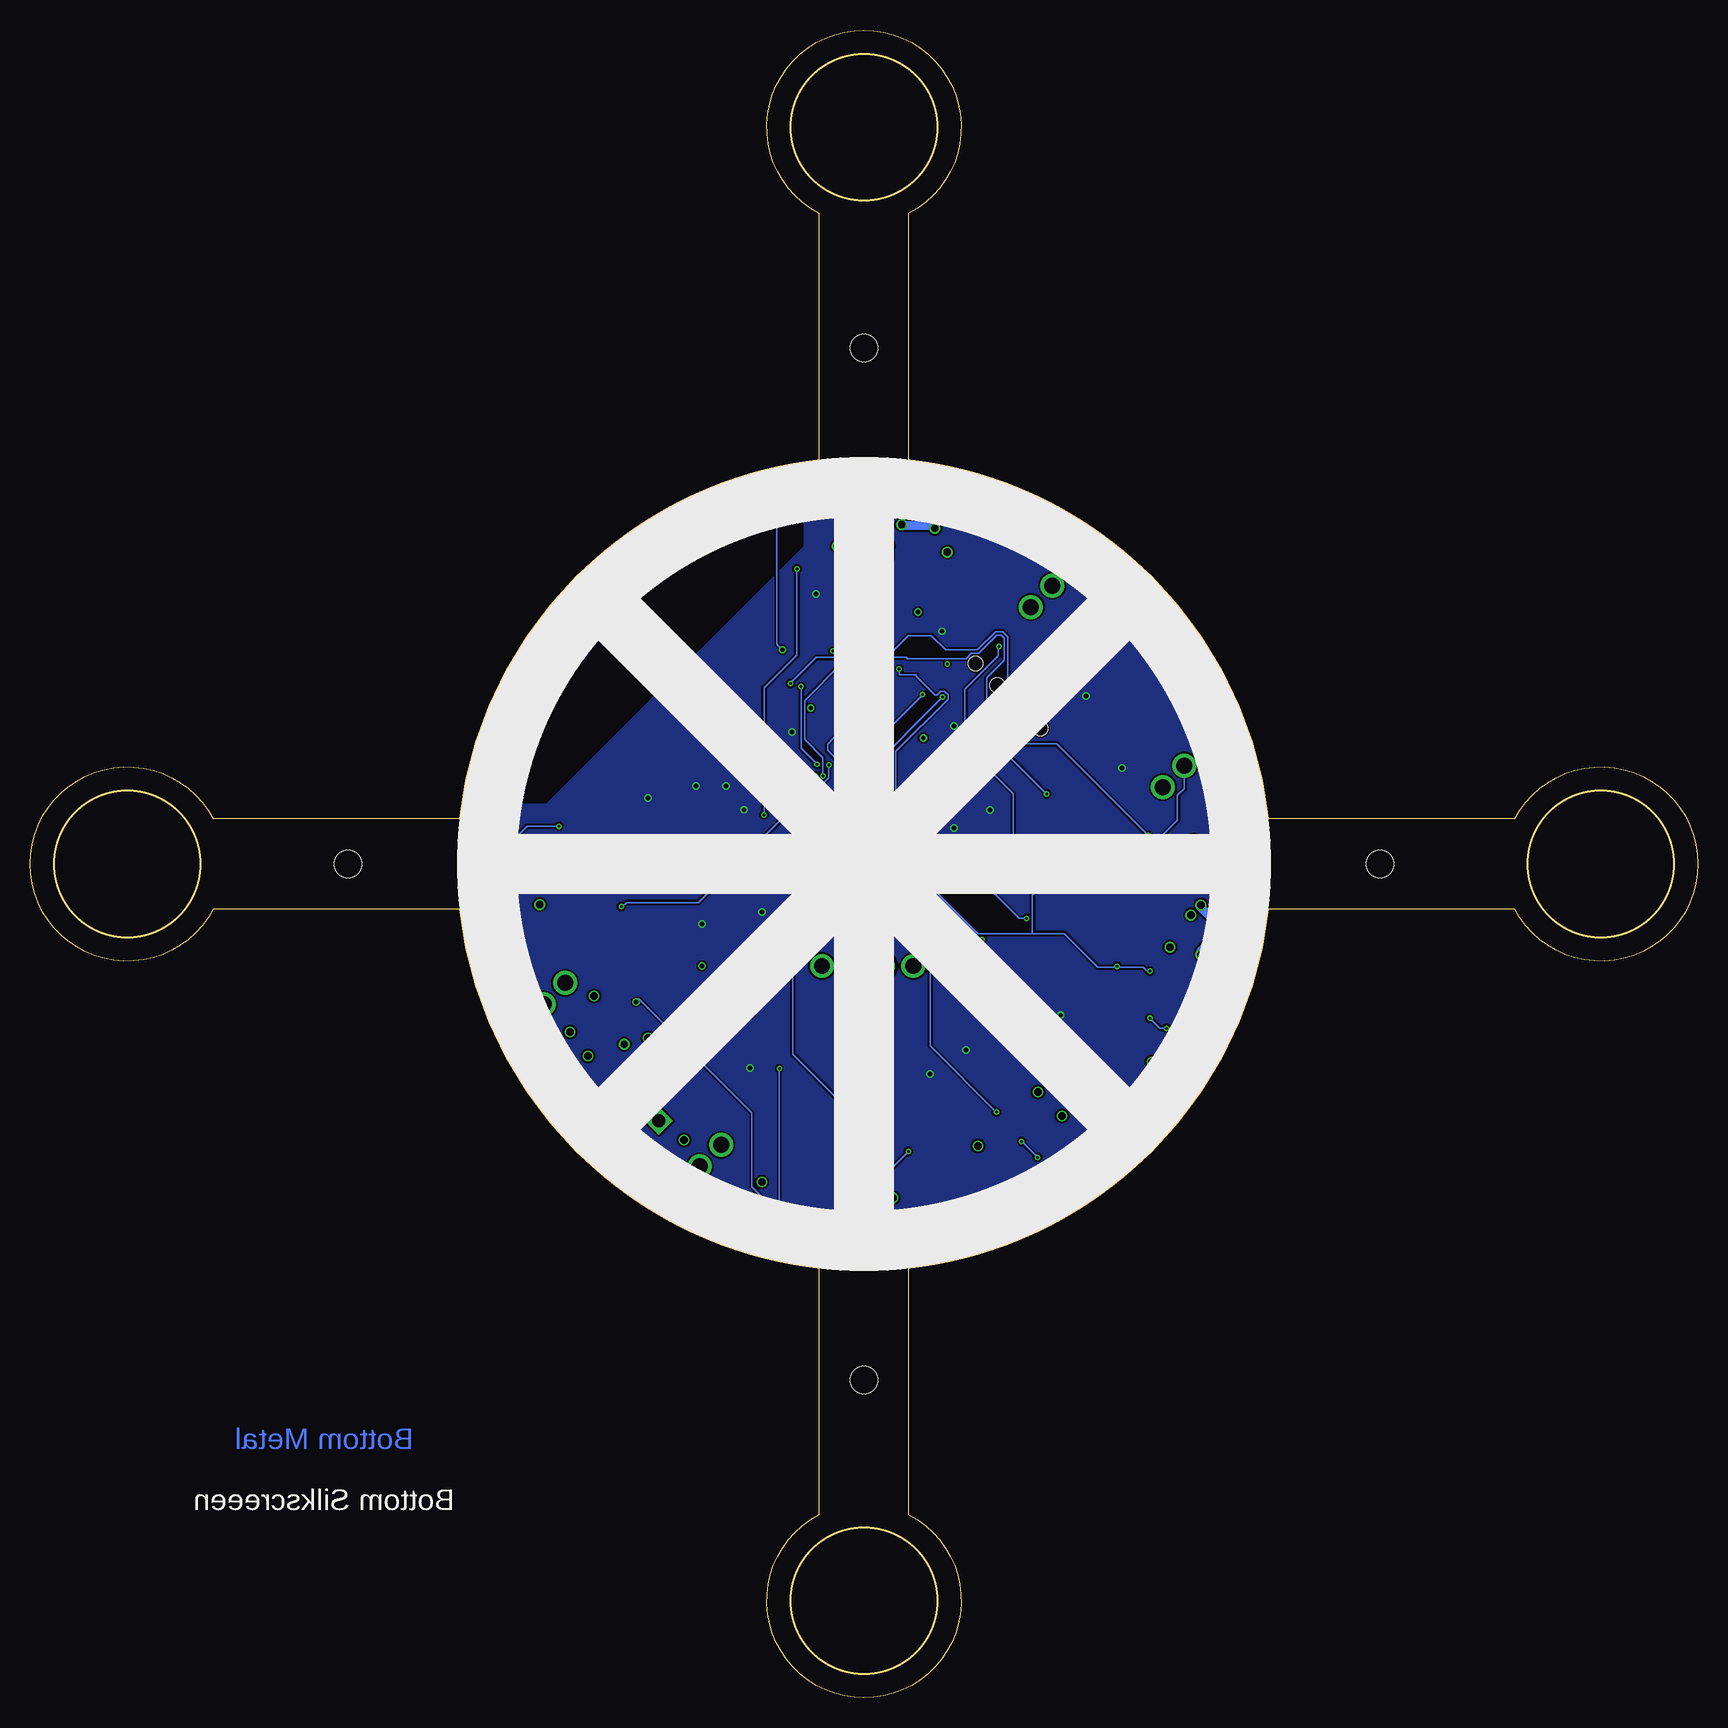
[diagram p4: board, bottom side, seen from below]

Size 139 x 139 mm. Coordinates in mm from the lower left corner, seen from the top.
Outline: 73.25,35.81 arc77 103.19,65.75 123.72,65.75 arc305 123.72,73.25 103.19,73.25 arc77 73.25,103.19 73.25,123.72 arc305 65.75,123.72 65.75,103.19 arc77 35.81,73.25 15.28,73.25 arc305 15.28,65.75 35.81,65.75 arc77 65.75,35.81 65.75,15.28 arc305 73.25,15.28 73.25,35.81
Outline: circle at 130.9,69.5 radius 6.1
Outline: circle at 69.5,8.1 radius 6.1
Outline: circle at 69.5,130.9 radius 6.1
Outline: circle at 8.1,69.5 radius 6.1
Copper layers (1*2*15*16): Top / Route2 / Route15 / Bottom
Stack-up Default Layer Stack: Top User Defined 0.035559375mm / Dielectric-2 User Defined 1.501140625mm / Route2 User Defined 0.035559375mm / Dielectric-1 User Defined 0.149859375mm / Route15 User Defined 0.035559375mm / Dielectric-3 User Defined 0.200659375mm / Bottom User Defined 0.035559375mm
Design rules "pcbcart-4layer-5mil-small-cream": minimum track width 5mil, minimum drill 8mil, track to track 6mil, track to pad 6mil, pad to pad 6mil, via to via 6mil, smd to smd 6mil, copper to edge 0.2mm, drill to drill 10mil, minimum pad ring 5mil, minimum via ring 5mil, stop-mask expansion 3mil, vias tented up to drill 0.45mm, thermal gap 10mil

### Footprints (pad centres in the part's own frame; a part is rotated, then mirrored left to right if it is on the bottom)
ANT_PCB_2.4GHZ_NRF8001_1.6MM_1OZ = smd 1.27 x 1.27: FEED 0,0; TESTPOINT -8.169,17.605
SCREW-TERMINAL-1X2-2.54MM = drill 1.1 square: 1 -1.27,0 | drill 1.1: 2 1.27,0
TE_FSM8JSMA_HS = smd 1.4 x 2.1: 1 -2.25,4.55; 2 -2.25,-4.55; 3 2.25,4.55; 4 2.25,-4.55
CAPC2012X140_HS = smd 1.08 x 1.42: 1 -0.895,0; 2 0.895,0
CAPMP3216X180 = smd 1.735 x 1.315: 1 -1.34,0; 2 1.34,0
0805_LED = smd 1.2 x 1.2: A -1.05,0; C 1.05,0
LEDSC125X200X120-2_HS = smd 0.94 x 0.99: A -1.045,0; C 1.045,0
SODFL3516X96 = smd 0.962 x 1.029: 1 -1.525,0; 2 1.525,0
2-56-MOUNTING-HOLE-NO-METAL = hole 2.261: 0,0
IMU_LSM6DS0X = smd 0.475 x 0.25: 1 -1.163,0.75; 2 -1.163,0.25; 3 -1.163,-0.25; 4 -1.163,-0.75; 8 1.163,-0.75; 9 1.163,-0.25; 10 1.163,0.25; 11 1.163,0.75 | smd 0.25 x 0.475: 5 -0.5,-0.912; 6 0,-0.912; 7 0.5,-0.912; 12 0.5,0.912; 13 0,0.912; 14 -0.5,0.912
2X3-SMD = smd 1 x 3.15: 1 -2.54,-2.54; 2 -2.54,2.54; 3 0,-2.54; 4 0,2.54; 5 2.54,-2.54; 6 2.54,2.54
HEADER-1X4-BOTTOM-ENTRY = smd 1.5 x 2.1: 1 3.81,-1.85; 2 1.27,1.85; 3 -1.27,-1.85; 4 -3.81,1.85 | hole 1.2: -1.27,0; -3.81,0; 1.27,0; 3.81,0
HDRVR3W80P254_1X3_812X254X850B = drill 1.331 pad 1.997: 1 0,0; 2 2.54,0; 3 5.08,0
HDRVR4W80P254_1X4_1066X254X850B = drill 1.331 pad 1.997: 1 0,0; 2 2.54,0; 3 5.08,0; 4 7.62,0
MOLEX-0532610271 = smd 0.8 x 1.6: 1 -0.637,2.9; 2 0.613,2.9 | smd 2.1 x 3: G1 -3.175,0; G2 3.175,0
QFN-64 = smd 1.562 x 0.28: 1 -4.881,3.75; 2 -4.881,3.25; 3 -4.881,2.75; 4 -4.881,2.25; 5 -4.881,1.75; 6 -4.881,1.25; 7 -4.881,0.75; 8 -4.881,0.25; 9 -4.881,-0.25; 10 -4.881,-0.75; 11 -4.881,-1.25; 12 -4.881,-1.75; 13 -4.881,-2.25; 14 -4.881,-2.75; 15 -4.881,-3.25; 16 -4.881,-3.75; 33 4.881,-3.75; 34 4.881,-3.25; 35 4.881,-2.75; 36 4.881,-2.25; 37 4.881,-1.75; 38 4.881,-1.25; 39 4.881,-0.75; 40 4.881,-0.25; 41 4.881,0.25; 42 4.881,0.75; 43 4.881,1.25; 44 4.881,1.75; 45 4.881,2.25; 46 4.881,2.75; 47 4.881,3.25; 48 4.881,3.75 | smd 0.28 x 1.562: 17 -3.75,-4.881; 18 -3.25,-4.881; 19 -2.75,-4.881; 20 -2.25,-4.881; 21 -1.75,-4.881; 22 -1.25,-4.881; 23 -0.75,-4.881; 24 -0.25,-4.881; 25 0.25,-4.881; 26 0.75,-4.881; 27 1.25,-4.881; 28 1.75,-4.881; 29 2.25,-4.881; 30 2.75,-4.881; 31 3.25,-4.881; 32 3.75,-4.881; 49 3.75,4.881; 50 3.25,4.881; 51 2.75,4.881; 52 2.25,4.881; 53 1.75,4.881; 54 1.25,4.881; 55 0.75,4.881; 56 0.25,4.881; 57 -0.25,4.881; 58 -0.75,4.881; 59 -1.25,4.881; 60 -1.75,4.881; 61 -2.25,4.881; 62 -2.75,4.881; 63 -3.25,4.881; 64 -3.75,4.881
NET_BRIDGE = smd 0.5 x 0.5: 1 -0.25,0; 2 0.25,0
SOT23-3-NMOSFET = smd 2.05 x 2.9: D 0.875,0 | smd 1.5 x 1: G -1.15,0.95; S -1.15,-0.95
RESC2012X60_HS = smd 0.92 x 1.38: 1 -0.955,0; 2 0.955,0
0805_RESISTOR = smd 1 x 1.2: 1 -1,0; 2 1,0
BALUN = smd 0.35 x 1: 1 -0.65,-0.8; 2 0,-0.8; 3 0.65,-0.8; 4 0.65,0.8; 5 0,0.8; 6 -0.65,0.8
SOT23-DBV = smd 0.55 x 1.2: 1 -0.95,-1.3; 2 0,-1.3; 3 0.95,-1.3; 4 0.95,1.3; 5 -0.95,1.3
JS102011SAQN = smd 1.2 x 2.5: A -2.5,2.75; B 2.5,2.75; C 0,2.75 | hole 0.9: -3.4,0; 3.4,0
CRYSTAL-SMD-5X3 = smd 1.9 x 1.1: 1 -1.85,-1.15; 2 1.85,-1.15; 3 1.85,1.15; 4 -1.85,1.15

### Placement (x,y rotation side)
A8  83.5,90.5 215 top
B1  87.5,49 45 top
B3  47.5,86.5 315 top
C1  75.5,70 315 top
C2  85.5,81 315 top
C3  77.5,89.5 304 top
C4  82.5,88.5 135 top
C5  82.5,68.5 225 top
C6  86,72 225 top
C7  71.5,90 0 top
C8  85,77 315 top
C9  50,80.5 315 top
C10  73,67 45 top
C11  64.5,78 0 top
C12  53.5,52.5 0 top
C13  92,55.5 45 top
C14  84.5,59.5 225 top
C15  79,61 90 top
C16  66,66 135 top
D1  53.5,43.5 225 top
D2  42.5,55 225 top
D3  70,45 0 top
D4  92.5,70 180 top
D5  64.5,94.5 270 top
D6  45,65.5 0 top
D7  69.5,39 270 bottom
D8  100,69.5 180 bottom
D9  69.5,100 90 bottom
D10  39,69.5 0 bottom
DECO1  114.5,38.5 0 top
H1  26.5,69.5 0 top
H2  69.5,26.5 0 top
H3  112.5,69.5 0 top
H4  69.5,112.5 0 top
IM  69.5,69.5 45 top
J1  58,65.5 0 top
J2  57.5,83.5 45 top
J3  85,42.5 135 top
J4  52,94.5 315 top
J5  98,56 135 top
J6  41,79.5 315 top
J8  73,61 180 top
LOGO  63.5,54 0 top
LOGO1  69.5,69.5 0 bottom
M1  69.5,38.5 0 top
M2  100.5,69.5 90 top
M3  69.5,100.5 180 top
M4  38.5,69.5 270 top
MC  75,80 225 top
N1  89.5,60.5 135 top
Q1  75.5,44 90 top
Q2  93,65.5 180 top
Q3  60,95.5 90 top
Q4  44.5,60.5 180 top
Q5  63.5,46.5 270 top
Q6  94.5,74.5 180 top
Q7  77,99 270 top
Q8  46,70 0 top
R1  49.5,56.5 0 top
R2  57,58.5 0 top
R3  57.5,47.5 0 top
R4  75.5,48.5 0 top
R5  86.5,64 0 top
R6  70,93.5 0 top
R7  49.5,62 270 top
R8  78,39.5 0 top
R9  75.5,53.5 0 top
R10  61,40 180 top
R11  69.5,50 0 top
R12  87,67 0 top
R13  100.5,61.5 270 top
R14  75,94.5 0 top
R15  38.5,61 315 top
R16  59.5,76.5 0 top
R17  65,82.5 225 top
R18  61.5,100 180 top
R19  66,88.5 45 top
RD  80.5,86 225 top
RG  88,57.5 45 top
S1  46.5,48 315 top
Y1  81.5,73 45 top

### Tracks (layer width: path | path; a pad name or v marks a point on that pad's centre or on a via)
3  (via drill 0.2)
  Top 0.127: v70.69,48.89 70.48,49.1 70.48,49.73 | 70.48,49.73 70.48,49.94 R11.2 70.48,49.73 | 70.48,49.73 69.78,49.73 69.57,49.52 69.57,49.31 68.24,47.99 65,47.98 64.78,47.98 Q5.G | v75.44,73.48 75.79,73.83 MC.49
  Bottom 0.127: v75.44,73.48 75.44,53.64 v70.69,48.89
3V  (via drill 0.35)
  Top 0.254: 86.4,57.69 RG.5 86.41,58.86 C14.1 83.87,60.13 v83,61 | v60,59 58.94,58.37 R2.2 | MC.44 72.77,75.32 73.4,75.95 73.47,75.95 74.09,76.58 74.64,76.58 74.92,76.31 | MC.54 77.59,75.67 76.95,76.31 74.92,76.31 | 79.47,60.13 C15.1 v79,57 | v83.22,82.47 83.56,82.13 84.37,82.13 C2.1 | C16.2 64,68 v64,69.5 | R19.2 66.69,89.14 65.33,90.5 v65,90.5 | 72.01,84.03 MC.23 73.56,82.5 v73.94,82.5 | MC.59 79.28,77.46 78.35,78.39 v78.35,78.81 | R17.2 64.33,81.79 64.55,81.57 v64.55,80 | MC.34 69.22,78.79 68.38,77.95 68,77.95 v67.55,77.5 66.34,77.5 C11.2 65.43,78.12 | v74.9,76.29 74.92,76.31 | v72.05,70.99 v72.05,71 | IM.5 70,68.29 v70,67.5 71.23,67.5 C10.1 | IM.12 68.52,71.19 v68.52,71.25 | IM.8 70.85,69.8 v72.05,71 | v72.05,71 74.5,71 C1.1
  pour Route15: 73.5,93.5 62,93.5 45,76.5 45,64.5 65,44.5 74.5,44.5 94.5,64.5 94.5,74.5
4
  Top 0.127: 87.94,68.17 87.94,68.52 91.57,72.15 95.06,72.15 95.41,72.5 95.41,73.27 95.62,73.48 Q6.G | 87.94,68.17 87.94,67.05 R12.2 | 87.94,68.17 85.5,68.17 85.29,67.96 83.19,67.96 82,69.15 80.82,69.15 77.88,72.08 77.88,72.22 76.76,73.34 76.76,73.55 76.21,74.11 76.21,74.25 MC.50
5  (via drill 0.2)
  Top 0.127: v77.83,73.59 77.52,73.59 MC.51 | Q7.G 77.95,100.09 77.95,99.95 78.86,99.05 78.86,96.88 76.48,94.51 76,94.51 R14.2 75.93,94.44 75.79,94.3 75.3,94.3 v75.09,94.09
  Bottom 0.127: v77.83,73.59 77.83,84.17 75.09,86.91 v75.09,94.09
19  (via drill 0.2)
  Top 0.127: Q8.G 45.77,71.87 v45.82,71.87 | MC.19 73.49,85.52 72.43,86.58 72.43,86.9 v72.08,87.24 | v58.81,82.14 60,80.96 60,76.95 R16.2
  Bottom 0.127: v72.08,87.24 67.09,87.24 65.81,88.52 63.88,88.52 62.7,87.34 60.06,87.34 58.54,88.86 57.94,88.86 57.51,88.43 57.51,82.42 57.79,82.14 v58.81,82.14 56.17,79.5 53.45,79.5 v45.82,71.87
A0  (via drill 0.2)
  Top 0.127: v76.55,52.46 76.55,53.43 R9.2 | v76.83,40.58 77.04,40.37 77.04,39.53 R8.1
  Bottom 0.127: v76.55,52.46 76.55,40.86 v76.83,40.58
BAT_GND  (via drill 0.61)
  Top 0.762: 66.79,100.37 66.7,100.5 M3.G2 v64.5,100.5 | M1.G2 73.14,38.5 73.14,38.49 74.99,38.49 v75,38.5 | v38.5,74.5 M4.G1 | M4.G2 v38.5,64 | M2.G1 v100.5,64.5 | M3.G1 v74.5,100.5 74.88,100.65 75.58,100.65 75.72,100.51 75.79,100.51 76,100.3 76,100.16 Q7.S | v45.5,53 45.5,52.89 S1.A | M2.G2 101.5,73.67 v101.5,74.99 v101.51,75 | M1.G1 v64,38.5 | C12.2 55,52.34 v55,50.5 | C13.2 93.27,55.5 v94,55.5 | RG.2 89.48,56.02 v89.48,54.47 | v96.52,66.11 96.09,66.11 95.12,67.08 94.78,67.08 Q2.S | Q1.S 76.48,42.89 76.62,42.89 76.83,43.1 77.81,43.1 77.95,42.96 v78,43 | Q8.S 44.84,69.01 43.01,69.01 v43,69 | 61.55,47.65 60,46.1 60.07,46.03 60,45.96 v60,46 | Q6.S 95.69,75.44 98.07,75.44 98.49,75.02 v98.51,75 | Q4.S 45.18,61.92 45.18,62.17 44.79,62.56 v44,62.56 | Q3.S 61.42,94.35 v62.56,95.49 | v92,58.5 91.5,58.5 N1.1 | 61.55,47.65 | 61.55,47.65 Q5.S
  Bottom 0.762: J3.1 83.5,41 | 62.57,95.54 v62.56,95.49
  other vias: 84.5,46.5
  pour Route2: 74.5,103 74.5,96 73.5,95 62,95 44,77 44,64 65,43 74.5,43 96,64.5 96,76 103,76 103,47.5 92,36.5 53,36.5 36,53.5 36,102.5
GND  (via drill 0.35)
  Top 0.254: 77.9,77.5 78.08,77.68 | 84.97,83.05 84.48,83.05 84.14,82.71 | 77.19,76.91 | 77.19,76.91 77.25,76.97 77.32,76.97 | MC.45 73.2,75.02 73.74,75.56 74.34,75.56 74.5,75.4 | MC.58 78.95,77.08 78.35,77.68 78.08,77.68 | 78.08,77.68 78.03,77.68 77.74,77.39 | MC.55 77.19,76.75 77.19,76.91 | MC.24 70.85,84.5 70.5,84.5 | IM.7 IM.6 | 83.5,86.5 83.13,86.87 C4.1
  other vias: 48,77.5 59,74 75.5,80.5 64,52 79,52.5 83,64.5 61,54 87.5,75 62,81 51,83.5 55,40.5 41,57.5 43.5,83 64.6,76 62.43,74.93 63,88.9 53.09,56.91 82.01,83 79.5,74.02 81,76 78,65.5 78.5,68 62,72.5 73.5,92 75,75.5 77,77.5 66.94,69.5 67.48,68 72.03,69.5 83.5,76
  pour Route2: 73.5,93.5 62,93.5 45,76.5 45,64.5 65,44.5 74.5,44.5 94.5,64.5 94.5,74.5
  pour Top: 74.48,104 91.22,74.5 103,74.5 103,47.5 91,35.5 54,35.5 36,53.5 36,103.5
  pour Bottom: 74.5,103.01 74.5,96 96,74.5 103,74.5 103,47.5 92,36.5 53,36.5 36,53.5 36,102.51
MISO  (via drill 0.2)
  Top 0.127: J1.1 55.24,62.96 54.74,63.47 55.74,64.47 55.74,64.75 v55.95,64.96 | v70.27,76.07 70.2,76.14 70.2,76.21 70.9,76.9 70.9,77.04 MC.39 | v68.27,74.06 67.59,74.74 v66.36,74.74
  Bottom 0.127: v66.36,74.74 56.58,64.96 v55.95,64.96 | v68.27,74.06 v70.27,76.07
MOSI  (via drill 0.2)
  Top 0.127: v71.32,78.44 71.46,78.3 71.11,77.95 71.11,77.88 70.69,77.46 MC.38 | v64.61,83.61 64.47,83.47 64.47,83.33 64.12,82.98 62.65,82.98 v60.63,80.95 | v57.07,69.64 57.35,69.36 57.56,69.36 57.97,68.94 57.97,68.1 J1.4
  Bottom 0.127: v71.32,78.44 69.78,78.44 v64.61,83.61 | v60.63,80.95 60.63,80.5 60.63,78.93 57.07,75.37 v57.07,69.64
N$1  (via drill 0.2)
  Top 0.127: v55.04,45.05 54.27,44.28 D1.A | v56.37,46.38 56.37,46.52 56.44,46.59 56.44,47.43 56.51,47.5 R3.1
  Bottom 0.127: v56.37,46.38 v55.04,45.05
N$2
  Top 0.127: J2.4 53.08,82.11 52.1,81.13 C9.1
N$3
  Top 0.152: C3.2 79.93,86.82 RD.2
N$4
  Top 0.127: RD.4 80.33,84.97 MC.8
N$5
  Top 0.127: RD.3 79.47,84.83 MC.9
N$6
  Top 0.127: RD.1 80.52,87.02 80.75,87.25
  Top 1.27: 80.75,87.25 80.75,88.02 C4.2 81.87,89.37 82.5,90 83,90 A8.FEED
N$7
  Top 0.127: MC.60 80.47,77 82.73,77 83.37,77.63 C8.1
N$8
  Top 0.127: C7.1 71.6,89 71.6,85.42 | 71.6,85.42 71.6,85.16 MC.22 | MC.21 72.66,84.69 72.1,85.25 71.77,85.25 71.6,85.42
N$9
  Top 0.127: MC.57 80.35,75 81.93,75 81.93,75.09 Y1.3 84.64,75.12 86.13,73.63 86.13,73.13 C6.1
N$10
  Top 0.127: C5.1 82.75,69.13 Y1.1 80.65,71.23 80.65,73.99 MC.56
N$11  (via drill 0.2)
  Top 0.127: v44.28,55.81 44.14,55.81 43.77,55.44 D2.A | R1.1 48.53,56.65 v45.68,56.65
  Bottom 0.127: v44.28,55.81 44.84,55.81 v45.68,56.65
N$12
  Top 0.762: M1.2 70.13,41.42 70.13,42.54 70.06,42.61 70.06,42.75 70.2,43.1 70.9,43.79 71.25,43.79 71.53,44.07 71.53,44.63 D3.2 71.53,44.98 75.37,44.98 75.44,44.91 Q1.D
N$13
  Top 0.762: Q2.D 92.06,65.52 91.57,66.01 91.57,67.33 91.01,67.89 91.01,69.99 D4.2 91.36,69.99 91.78,69.99 93.04,71.25 96.95,71.25 97.58,70.62 97.58,70.13 M2.2
N$14  (via drill 0.61)
  Top 0.762: v66.36,97.79 66.63,97.51 68.8,97.51 M3.2 68.94,97.16 68.94,96.95 68.87,96.88 68.94,96.81 68.94,96.67 68.87,96.6 68.87,95.69 68.24,95.06 68.17,95.06 68.03,94.92 67.82,94.92 67.68,94.79 67.61,94.79 67.26,94.44 67.26,94.23 66.01,92.97 65.38,92.97 65.37,92.97 D5.2 | v63.6,97.47 63.49,97.47 63.38,97.36 60.99,97.36 Q3.D
  Bottom 0.762: v66.36,97.79 66.29,97.72 63.84,97.72 v63.6,97.47
N$15  (via drill 0.61)
  Top 0.762: v41.42,61.93 42.84,61.93 Q4.D 44.14,60.13 44.14,59.05 44.68,58.52 46.62,58.52 47.15,59.04 47.15,64.14 46.52,64.77 D6.2 | M4.2 41.42,68.87 v41.42,66.08
  Bottom 0.762: v41.42,61.93 41.42,62.22 40,63.65 40,64.47 41.42,65.89 v41.42,66.08
N$16  (via drill 0.2, 0.35)
  Top 0.127: S1.C 48.4,49.94 48.06,49.59 48.06,48.82 48.4,48.47 48.4,47.64 49.59,46.45 50.22,46.45 56.28,40.39 56.28,39.33 56.41,39.2 57.06,39.2 58.41,37.85 60.64,37.85 61.47,37.02 63.7,37.02 64.26,36.46 v74.67,36.46 | RG.3 88.84,58 v88.5,58
  Bottom 0.127: v88.5,58 88.25,58.25 v86,56 85.98,55.95 85.98,55.88 78.86,48.75 78.86,42.61 77.32,41.07 77.32,39.11 v74.67,36.46
N$19  (via drill 0.2)
  Top 0.127: v65.8,45.54 65.38,45.96 64.5,45.96 64.15,45.96 63.84,45.96 Q5.D
  Bottom 0.127: D7.C 69.5,38.35 70.2,39.04 70.27,39.04 70.48,39.25 70.48,40.86 v65.8,45.54
N$20  (via drill 0.2)
  Top 0.127: v62.93,40.09 62.86,40.16 62.17,40.16 R10.1
  Bottom 0.127: v62.93,40.09 69.5,40.09 D7.A
N$23  (via drill 0.2)
  Top 0.127: v94.92,72.64 93.67,73.9 93.67,74.46 Q6.D
  Bottom 0.127: D8.C 100.65,69.5 99.95,70.2 99.95,70.27 97.58,72.64 v94.92,72.64
N$24  (via drill 0.2)
  Top 0.127: v100.02,63.35 100.3,63.07 100.3,62.65 100.44,62.51 R13.1
  Bottom 0.127: v100.02,63.35 98.98,64.4 98.98,69.5 D8.A
N$27  (via drill 0.2)
  Top 0.127: v75.16,98.63 75.65,98.14 76.97,98.14 Q7.D
  Bottom 0.127: v75.16,98.63 72.71,101.07 69.5,101.07 D9.C
N$28  (via drill 0.2)
  Top 0.127: v63.35,99.95 63.31,100 R18.1
  Bottom 0.127: v63.35,99.95 64.33,98.98 69.5,98.98 D9.A
N$31  (via drill 0.2)
  Top 0.127: Q8.D 46.87,69.99 46.87,69.5 45.61,68.24 v45.61,68.1
  Bottom 0.127: D10.C 38.35,69.5 39.04,70.2 39.04,70.27 39.25,70.48 43.24,70.48 v45.61,68.1
N$32  (via drill 0.2)
  Top 0.127: v38,63.15 38,61.85 R15.1
  Bottom 0.127: v38,63.15 37.65,63.5 37.65,64.4 40.02,66.78 40.02,69.5 D10.A
PG0  (via drill 0.2)
  Top 0.127: v75.63,84.54 76.47,85.38 MC.14 | R1.2 51.95,56.5 54.22,58.77 54.22,71.57 54.62,71.96 54.62,75.04 54.49,75.17 54.44,75.17 v54.27,75.33
  Bottom 0.127: v54.27,75.33 59.26,80.32 59.26,85.01 57.79,86.48 57.79,88.32 58.05,88.58 58.42,88.58 59.94,87.06 60.55,87.06 60.98,86.62 65.88,86.62 65.96,86.71 73.47,86.71 v75.63,84.54
PG1  (via drill 0.2)
  Top 0.127: v58.46,48.82 58.46,47.57 R3.2 | v74.73,84.27 75.42,84.96 75.42,85.03 76.12,85.73 MC.15 | v72.43,77.74 72.64,77.74 72.71,77.81 v73.41,77.81
  Bottom 0.127: v72.43,77.74 72.43,76.69 73.27,75.86 73.27,70 70.8,67.53 70.8,66.8 69.79,65.8 68.17,65.8 63.98,61.61 63.98,54.34 v58.46,48.82 | v74.73,84.27 74.73,79.13 v73.41,77.81
PWM1  (via drill 0.2)
  Top 0.127: 79.59,43.69 79.63,43.65 81.93,43.65 82.14,43.86 82.28,43.86 82.7,44.28 83.19,44.28 J3.2 | 79.59,43.69 79.21,44.07 79.21,44.21 76.48,46.94 76.48,48.47 R4.2 76.48,48.54 76.48,49.38 75.58,50.29 75.58,60.42 69.71,66.29 v69.71,66.35 | Q1.G 74.6,42.82 74.74,42.82 75.58,41.98 75.58,41.91 75.79,41.7 77.95,41.7 79.56,43.31 79.56,43.65 79.59,43.69 | v70.76,75.65 70.62,75.79 70.76,75.93 70.76,76 71.37,76.61 MC.40
  Bottom 0.127: v70.76,75.65 71.73,75.65 72.99,74.39 72.99,71.2 72.9,71.1 71.51,69.71 71.51,69.65 70.52,68.66 70.52,67.15 v69.71,66.35
PWM2  (via drill 0.2)
  Top 0.127: MC.41 71.79,76.44 72.56,77.21 72.57,77.25 72.85,77.53 v73.55,76.83 | J5.2 94.49,57.8 90.84,61.44 | 90.84,61.44 88.28,64 R5.2 87.86,64 89.78,65.92 89.76,65.94 v89.72,65.95 | 90.84,61.44 90.87,61.47 93.95,64.54 94.09,64.54 Q2.G
  Bottom 0.127: v89.72,65.95 89.72,66.01 89.55,66.01 89.27,66.29 83.33,66.29 75.13,74.48 74.78,74.48 73.55,75.72 v73.55,76.83
PWM3  (via drill 0.2)
  Top 0.127: 68.84,92.03 68.8,91.99 61.75,91.99 59.39,94.35 Q3.G 58.59,94.07 57.21,92.69 53.85,92.69 J4.2 | v72.92,76.83 73.06,76.69 72.99,76.62 72.78,76.62 72.29,76.14 72.15,76.14 MC.42 | 68.84,92.03 69.4,92.59 70.05,92.59 R6.2 | v71.11,86.26 71.11,87.59 69.35,89.35 69.35,91.51 68.84,92.03
  Bottom 0.127: v72.92,76.83 72.92,78.37 74.45,79.9 74.45,83.12 71.32,86.26 v71.11,86.26
PWM4  (via drill 0.2)
  Top 0.127: v45.68,60.57 45.68,59.58 Q4.G | v71.53,74.81 71.53,74.88 71.8,75.16 71.87,75.16 MC.43 | v48.4,60.98 48.47,61.05 49.45,61.05 R7.2
  Bottom 0.127: v71.53,74.81 71.18,74.81 70.64,74.27 70.14,74.27 69.88,74.01 69.88,73.51 68.42,72.05 68.19,72.05 67.72,71.58 67.72,71.23 66.79,70.3 66.61,70.3 60.01,63.7 55.46,63.7 | 55.46,63.7 52.81,63.7 50.01,60.91 48.4,60.91 | 48.4,60.91 46.24,60.91 45.89,60.56 45.68,60.56 v45.68,60.57 | 48.4,60.91 v48.4,60.98 | 55.46,63.7 55.46,66.92 54.97,67.4 49.1,67.4 43.38,73.13 43.38,75.23 42.82,75.79 42.82,77.67 J6.2
RESET  (via drill 0.35)
  Top 0.127: 44.95,84.69 44.91,84.73 42.84,84.73 B3.2 | 44.95,84.69 47.36,82.28 47.64,82.56 47.71,82.56 47.99,82.28 47.99,80.95 49.8,79.14 50.15,79.49 50.64,79.49 | MC.12 77.24,84.75 77.8,85.31 77.8,85.84 v76.29,87.35 | 44.95,84.69 44.98,84.73 44.98,87.16 B3.1 49.13,94.34 52,97.21 56,97.21 60.14,101.35 61.99,101.35 63,102.36 64.5,102.36 | R2.1 56.08,58.5 J1.5 58.72,64.78 58.72,69.7 56.44,71.98 56.44,73.79 54.46,75.78 54.41,75.79 50.64,79.56 | 50.64,79.56 50.64,79.84 C9.2 50.64,79.49 | 50.64,79.56 50.64,79.49
  Top 0.152: v76.76,101.85 76.44,102.17 74.69,102.17 74.5,102.36 64.5,102.36
  Bottom 0.127: v76.29,87.35 76.76,87.81 v76.76,101.85
RX0  (via drill 0.2)
  Top 0.127: v58.24,87.63 58.24,86.85 J2.2 | v72.5,73.9 72.71,73.69 72.78,73.69 72.92,73.83 72.92,73.97 72.99,74.04 72.99,74.11 MC.46 | v68.45,72.71 68.52,72.64 68.52,72.57 66.64,72.57 v65.1,74.11
  Bottom 0.127: v58.24,87.63 58.33,87.54 58.33,86.84 61.09,84.08 61.09,78.93 61.05,78.93 60.7,78.58 60.7,78.37 64.96,74.11 v65.1,74.11 | v72.5,73.9 72.5,74.46 71.66,75.3 71.04,75.3 70.29,74.55 70.03,74.55 69.6,74.13 69.6,73.86 v68.45,72.71
SCK  (via drill 0.2)
  Top 0.127: v59.65,63.21 58.25,63.21 58.04,63 J1.3 | v70.33,73.83 70.15,74.01 70.15,74.15 68.8,75.5 68.8,76.55 69.15,76.9 69.43,76.9 MC.37
  Bottom 0.127: v59.65,63.21 59.92,63.21 66.72,70.02 66.91,70.02 68,71.11 68,71.47 68.3,71.77 68.53,71.77 70.33,73.56 v70.33,73.83
SCL  (via drill 0.2)
  Top 0.127: J8.2 69.99,61.47 69.99,63.32 65.03,68.28 65.03,70.03 66.53,71.53 v67,71.53 67.47,71.53 IM.13 | R19.1 65.37,87.81 66.22,86.96 66.22,86.89 66.57,86.54 v66.57,85.76 68.1,85.76 69.98,83.89 70.69,83.89 70.83,83.75 70.9,83.75 71.32,83.33 MC.25
  Bottom 0.127: v66.57,85.76 66.57,85.26 65.13,85.26 65.13,85.13 63.57,83.57 63.43,83.57 63.08,83.91 62.8,83.91 62.5,83.61 62.5,83.25 66.85,78.9 66.85,71.68 v67,71.53
SDA  (via drill 0.2)
  Top 0.127: R17.1 65.73,83.19 66.01,83.19 66.5,83.68 v68.52,83.68 69.79,83.68 69.86,83.61 70.27,83.61 70.96,82.92 MC.26 | J8.1 65.43,68.57 65.43,69.69 v66.62,70.89 67.41,70.89 IM.14
  Bottom 0.127: v66.62,70.89 66.82,71.08 67.18,71.08 67.44,71.34 67.44,73.87 72.54,78.96 72.54,79.46 72,80 68.52,83.48 v68.52,83.68
TX0  (via drill 0.2)
  Top 0.127: v62.56,86.18 61.5,85.12 J2.1 61.82,85.36 62.94,84.23 v62.94,83.43 | v69.29,76.41 72.29,73.41 72.99,73.41 73.83,74.25 MC.47
  Bottom 0.127: v69.29,76.41 69.29,77.08 v62.94,83.43
VBAT  (via drill 0.61)
  Top 0.762: 97.58,68.87 M2.1 96.86,68.12 | 51.98,50.02 50.15,48.2 S1.B | 51.98,50.02 52.18,50.22 52.18,52.46 C12.1 | 79,39.54 R8.2 78.95,41.45 v79,41.5 | v96.68,67.73 96.68,67.94 96.86,68.12 | v53,48.5 51.98,49.52 51.98,50.02 | B1.2 v90,51.5 | v90,51.5 | D5.1 64.53,95.99 | 64.53,95.99 v67.46,95.99 | v42,71.5 42,70.74 M4.1 | C13.1 92.5,53.73 v92.5,53.5 | RG.1 87.5,55.16 v87.5,55 | M3.1 70,97.6 71.61,95.99 | 71.74,95.87 71.61,95.99 | D3.1 68.52,44.98 68.52,43.03 68.8,42.75 68.8,42.47 68.94,42.33 68.94,42.05 68.87,41.98 68.87,41.77 M1.1 68.8,41.42 67.38,41.42 67.12,41.63 v67.09,41.67 | v42.26,65.24 42.54,65.52 43.45,65.52 D6.1 | 96.86,68.12 94.99,69.99 94.09,69.99 D4.1 | v58,41 58.04,40.93 58.81,40.16 59.83,40.16 R10.2 | v40.58,59.72 40.09,60.21 39.96,60.32 R15.2 | R13.2 100.51,60.49 100.51,60 100.44,59.93 100.44,59.86 100.51,59.79 100.51,59.58 100.23,59.3 99.81,59.3 99.53,59.58 99.4,59.58 98.56,60.42 98.49,60.42 98.49,60.58 v98,61 | 71.61,95.99 71.66,96.04 v71.73,95.99 | 64.53,95.99 64.72,96.18 64.72,98.03 64.28,98.46 63.19,98.46 63,98.28 62.27,98.28 R18.2
  Bottom 0.762: v96.68,67.73 96.18,67.73 96.02,67.89 | v67.46,95.99 67.46,95
  pour Route15: 74.5,103 74.5,96 73.5,95 62,95 44,77 44,63.5 64.5,43 74.5,43 96,64.5 96,76 103,76 103,47.5 92,36.5 53,36.5 36,53.5 36,102.5
(copper drawn outside any net)
  shapes: Route15 area x1, Route2 area x1

### Text on the board
tPlace: GND | PWM3 | RX | TX | GND | GND | PWM4 | 3V | SCL | SDA | PWM2 | GND | PWM1 | GND
tNames: MC | RG